# Altium project FlightComputer.PrjPcb (part 1 of 2)
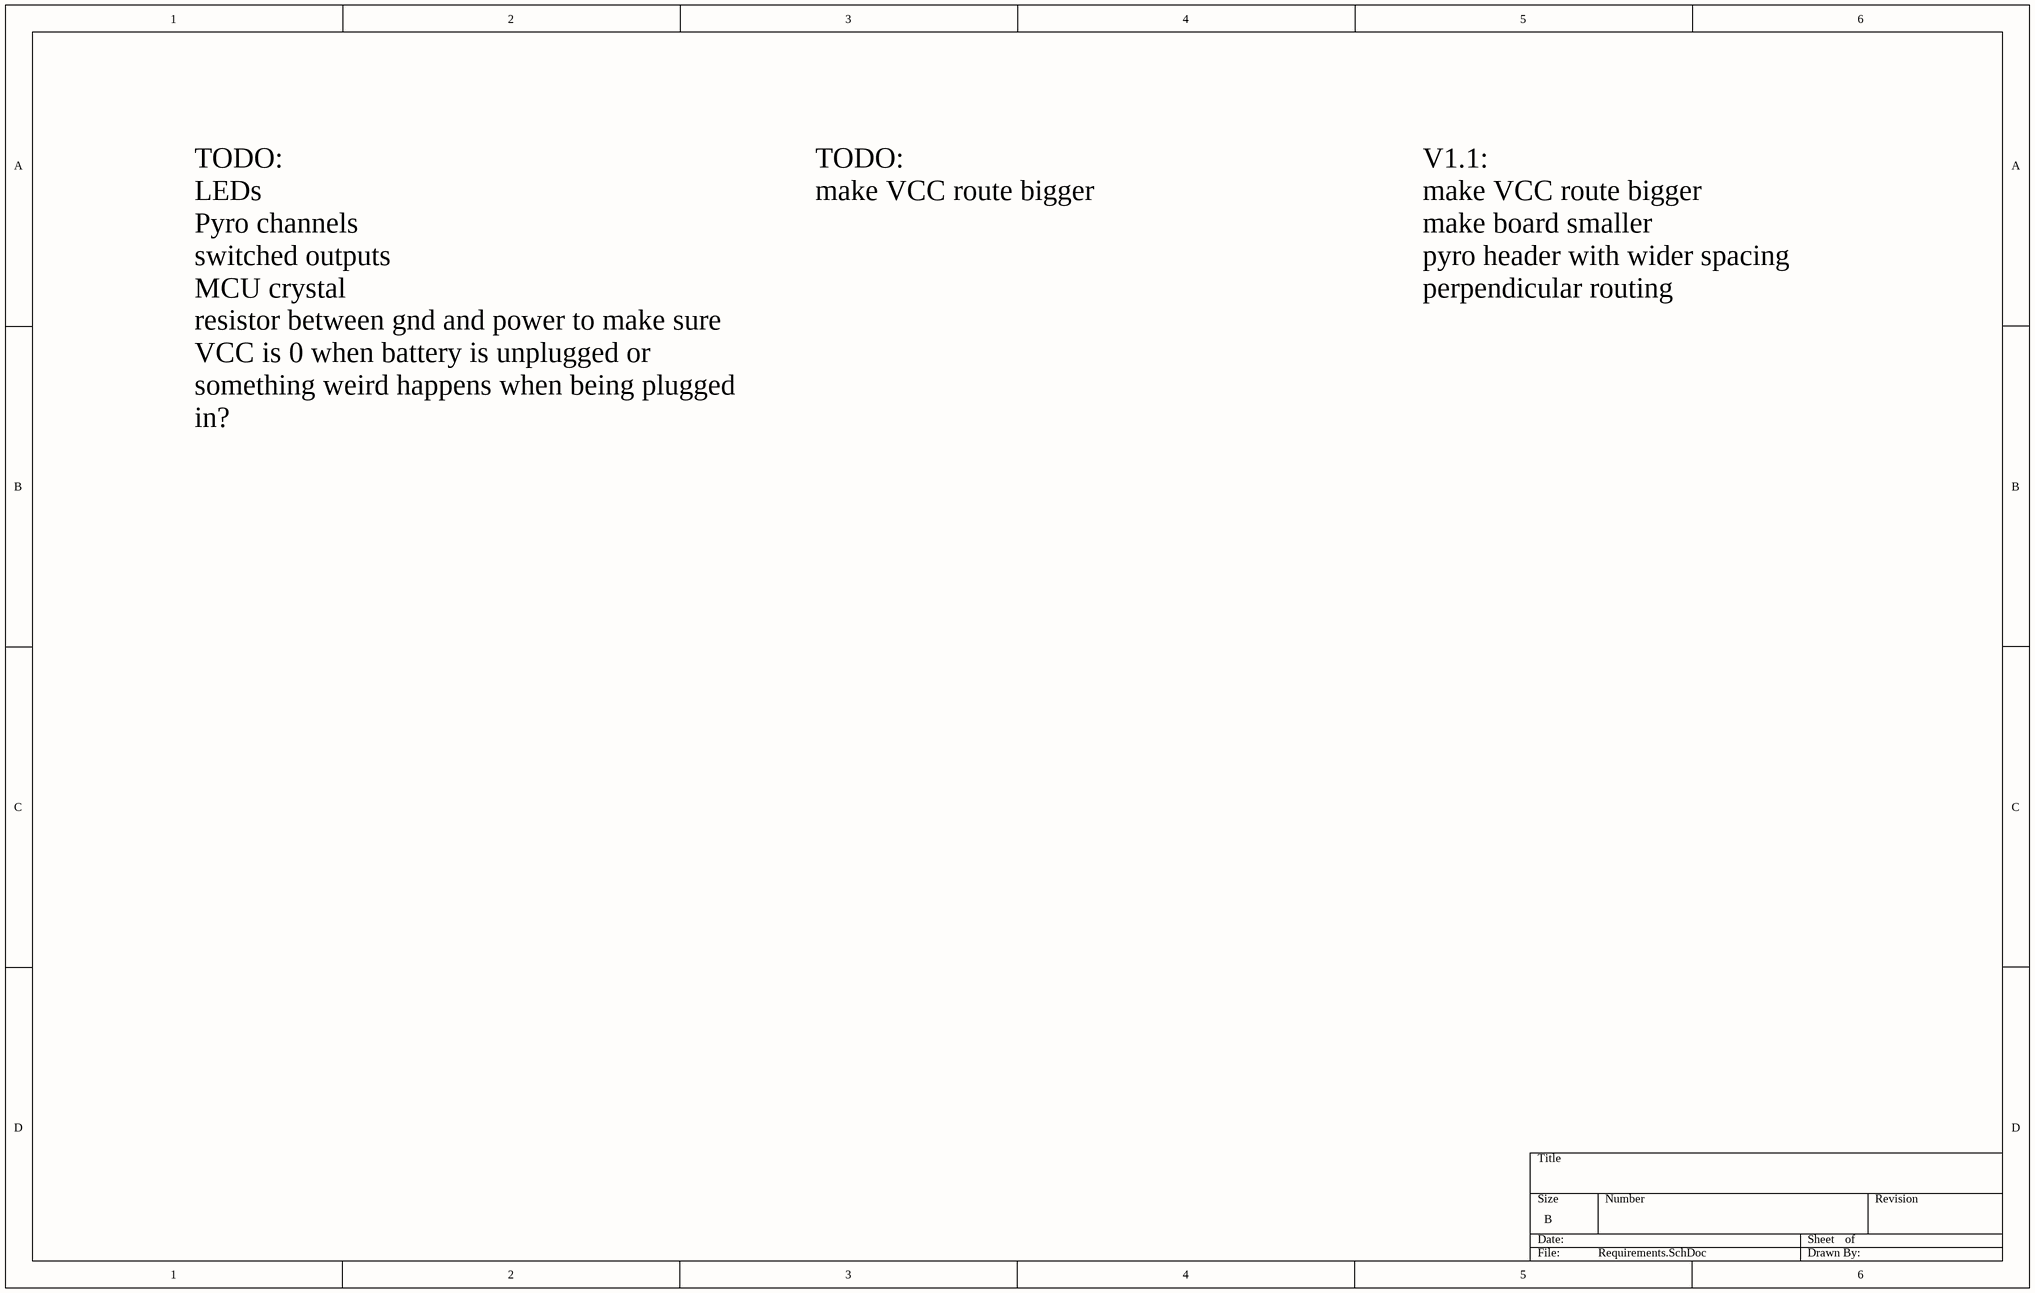
[diagram p0: Requirements.SchDoc]
7 sheets, 223 parts. Net scope: global (net labels, ports and power ports of the same name join across sheets).
Board file: PCB1.PcbDoc
Sheets:
  Requirements.SchDoc
  Power Supply.SchDoc
  Sensors.SchDoc
  MCU.SchDoc
  Pyro.SchDoc
  Misc Controls.SchDoc
  IO.SchDoc

## Sheet Requirements.SchDoc
size B; SheetNumber: 1; SheetTotal: 7

### Notes on the sheet
- TODO:
  LEDs
  Pyro channels
  switched outputs
  MCU crystal
  resistor between gnd and power to make sure VCC is 0 when battery is unplugged or something weird happens when being plugged in?
- TODO:
  make VCC route bigger
- V1.1:
  make VCC route bigger
  make board smaller
  pyro header with wider spacing
  perpendicular routing

## Sheet Power Supply.SchDoc
size B; SheetNumber: 2; SheetTotal: 7; SPICEModelCacheACFILVDY: <root> / <DocumentId>ACFILVDY</DocumentId> / <CacheFrame Number="0"> / <Model Name="0603_150060bs75000" Kind="CKT"> / <Text>****** / .subckt 0603_150060BS75000  1  2 / D1 1 2 SMCW / .MODEL SMCW D / + IS=316.72E-15 / + N=3.9746 / + RS=1.2476 / + IKF=130.15E-6 / + CJO=1.0000E-12 / + M=.3333 / + VJ=.75 / + BV=5 / + IBV=10.00E-6 / + TT=5.0000E-9 / .ends</Text> / </Model> / </CacheFrame> / </root>
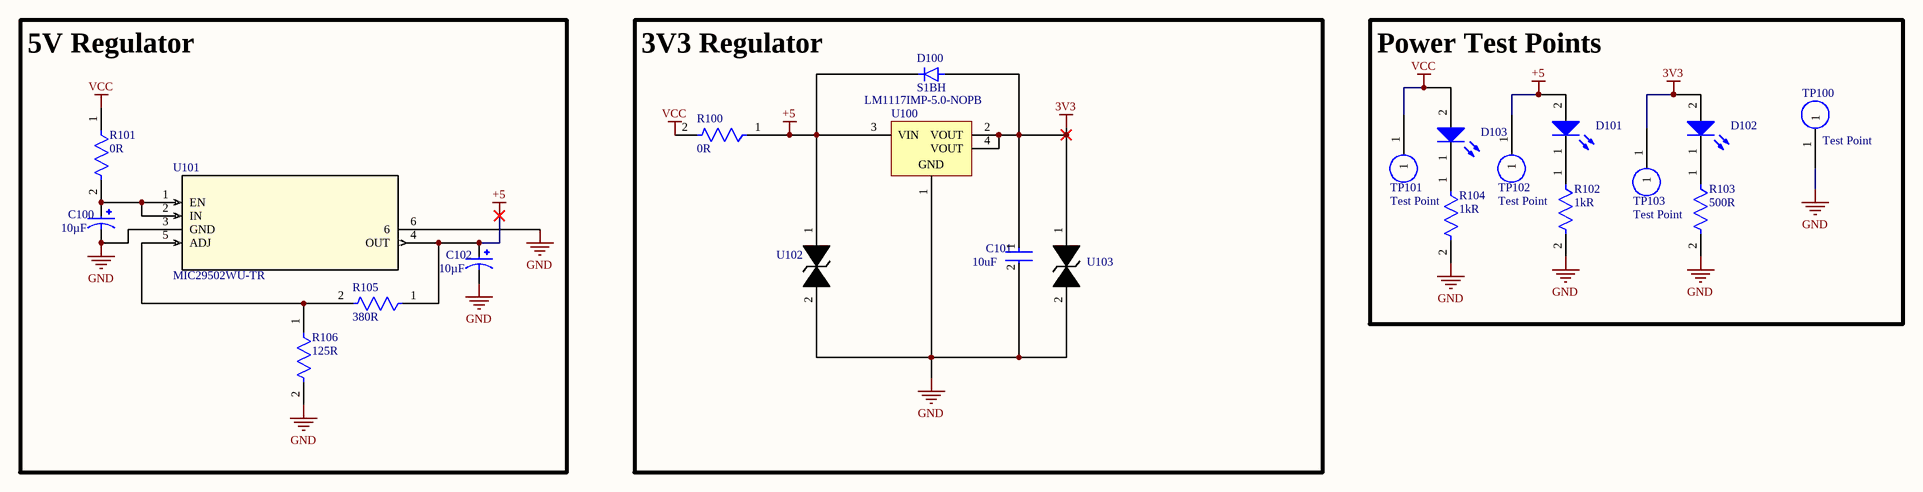
[diagram p1: Power Supply.SchDoc]

### Parts
C100  value 10µF  [CAP_EEEFN1C100R]  (hidden comment: EEEFN1C100R)
C101  Capacitance: 10uF  [FP-GRM21B-0_15-IPC_C]  (hidden comment: GRM21BR61E106KA73L)
C102  value 10µF  [CAP_EEEFN1C100R]  (hidden comment: EEEFN1C100R)
D100  S1BH  [DIOM4325X250N]
D101  150060BS75000  [WL-SMCW_0603_150060xx75000]  (value not drawn)
D102  150060BS75000  [WL-SMCW_0603_150060xx75000]  (value not drawn)
D103  150060BS75000  [WL-SMCW_0603_150060xx75000]  (value not drawn)
R100  value 0R  [FP-CPF0603-MFG]  (hidden comment: CPF0603B2K15E1)
R101  value 0R  [FP-CPF0603-MFG]  (hidden comment: CPF0603B2K15E1)
R102  value 1kR  [FP-CPF0603-MFG]  (hidden comment: CPF0603B2K15E1)
R103  value 500R  [FP-CPF0603-MFG]  (hidden comment: CPF0603B2K15E1)
R104  value 1kR  [FP-CPF0603-MFG]  (hidden comment: CPF0603B2K15E1)
R105  value 380R  [FP-CPF0603-MFG]  (hidden comment: CPF0603B2K15E1)
R106  value 125R  [FP-CPF0603-MFG]  (hidden comment: CPF0603B2K15E1)
TP100  Test Point  [2mm TP]
TP101  Test Point  [2mm TP]
TP102  Test Point  [2mm TP]
TP103  Test Point  [2mm TP]
U100  LM1117IMP-5.0-NOPB  [DCY0004A_M]
U101  MIC29502WU-TR  [TO-263-5_MCH]
U102  SP1003-01ETG  [SP1003-01ETG_LTF]  (value not drawn)
U103  SP1003-01ETG  [SP1003-01ETG_LTF]  (value not drawn)

### Blocks framed on the sheet
5V Regulator: C100 C102 R101 R105 R106 U101
3V3 Regulator: C101 D100 R100 U100 U102 U103
Power Test Points: D101-D103 R102-R104 TP100-TP103

### Nets
3V3: C101.1 D100.A D102.2(A) TP103.1 U100.2(VOUT) U100.4(VOUT) U103.1
+5: C102.1 D100.C(K) D101.2(A) R100.1 R105.1 TP102.1 U100.3(VIN) U101.4(OUT) U102.1
GND: C100.2 C101.2 C102.2 R102.2 R103.2 R104.2 R106.2 TP100.1 U100.1(GND) U101.3(GND) U101.6 U102.2 U103.2  [project net Pyro1-]
VCC: D103.2(A) R100.2 R101.1 TP101.1
NetC100_1: C100.1 R101.2 U101.1(EN) U101.2(IN)
NetD101_1: D101.1(K) R102.1
NetD102_1: D102.1(K) R103.1
NetD103_1: D103.1(K) R104.1
NetR105_2: R105.2 R106.1 U101.5(ADJ)

### Library data of the parts
C100 C102 = CMP-001-00085-1: 10ÂµF 16V Aluminum Electrolytic Capacitors Radial, Can - SMD 1.35Ohm @ 100kHz 2000 Hrs @ 105Â°C; MF: Panasonic; Digi-Key_Part_Number: 10-EEE-FN1C100RCT-ND; Design Item ID: EEEFN1C100R; Check_prices: https://www.snapeda.com/parts/EEEFN1C100R/Panasonic/view-part/5793981/?ref=eda; MP: EEEFN1C100R; Source: EEEFN1C100R.SchLib; Case/Package: RADIAL-2 Panasonic; Component Type: Standard; Pins: 2; SnapEDA_Link: https://www.snapeda.com/parts/EEEFN1C100R/Panasonic/view-part/5793981/?ref=snap
C101 = CMP-2007-03541-2: Chip Multilayer Ceramic Capacitors for General Purpose, 0805, 10uF, X5R, 15%, 10%, 25V; Length: 2mm; Depth: 1.25mm; Termination: SMD/SMT; Voltage: 25V; Height: 1.25mm; Material: Ceramic; Thickness: 0.053inch; Radiation Hardening: No; Min Operating Temperature: -55°C; Width: 0.049inch; Package Quantity: 1; Mount: Surface Mount; Dielectric: X5R; Packaging: Tape and Reel; Voltage Rating (DC): 25V; Lead Free: Lead Free; Max Operating Temperature: 85°C; Case Code (Imperial): 0805; Case/Package: 0805; Tolerance: 10%; Voltage Rating: 25V; Case Code (Metric): 2012
D100 = CMP-004-00033-1: Case/Package: None; Design Item ID: S1BH; Component Type: Standard; Availability: Unavailable; Price: None; Source: S1BH.SchLib; Value: *; Pins: 2; MP: S1BH
D101-D103 = CMP-004-00039-1: WL-SMCW Mono-color Chip LED Waterclear, SMT, size 0603, Blue, 3.2V, 140°; Manufacturer: Wurth Elektronik; Dominant Wavelength: 470nm; Luminous Intensity: 145mcd; Peak Wavelength: 465nm; Chip Technology: InGaN; Mount: Surface Mount; Viewing Angle: 140°; Component Type: Standard; Match Code: WL-SMCW; Emitting Color: Blue; Length: 1.6mm; ComponentLink1URL: https://www.we-online.com/redexpert/article/150060BS75000?ad; Design Item ID: 150060BS75000; ComponentLink2Description: Datasheet Link; ComponentLink2URL: https://www.we-online.com/redexpert/spec/150060BS75000?ad; Width: 0.8mm; Case/Package: 0603; Manufacturer Part Number: 150060BS75000; Forward Voltage: 3.2V; Source: WL-SMCW.SchLib; Category: Signal LEDs; Operating Temperature Min: -40°C; Pins: 2; ComponentLink1Description: Website Link; Height: 0.7mm; Operating Temperature Max: 85°C; Packaging: Tape and Reel
R100-R106 = CMP-03211-008657-1: RES SMD 2.15KΩ 0.1% 1/16W 0603; Manufacturer: TE Connectivity; Temperature Coefficient: 25ppm/°C; Voltage Rating: 50V; Power Rating: 0.063W; Height: 0.55mm; Series: CPF; ComponentLink2Description: Datasheet; Package: CPF0603; Automotive: No; octopart_url: https://octopart.com/cpf0603b2k15e1-te+connectivity-22739551; Lead Free: Yes; Temperature: -55°C to +155°C; RoHS: TRUE; Ipc Land Pattern Name: RESC15580X45; Temperature Range Low: -55°C; Composition: Thin Film; Device Class L3: Chip SMD Resistors; Category: Res; Octopart: https://octopart.com/cpf0603b2k15e1-te+connectivity-22739551; Resistance: 2.15KΩ; ComponentLink2URL: https://www.te.com/commerce/DocumentDelivery/DDEController?Action=showdoc&DocId=Data+Sheet%7F1773200%7FM%7Fpdf%7FEnglish%7FENG_DS_1773200_M.pdf%7F3-1676481-2; Manufacturer Part Number: CPF0603B2K15E1; packaging: 1k Reel; Tolerance: 0.1%; Temperature Range High: +155°C; Device Class L1: Passive Components; Device Class L2: Resistors
TP101 = CMP-096-000000-1: Source: Test_Points.SchLib; Design Item ID: Test Point
U100 = CMP-019-00021-3: Low-Dropout Linear Regulator, 800 mA, -40 to 125 degC, 4-Pin SOT-223 (DCY), Green (RoHS & no Sb/Br), Tape and Reel; Manufacturer: Texas Instruments; Dropout Voltage: 1.2V; Nominal Output Voltage: 5V; Max Ouput Current: 800mA; Outputs: 1; Min Input Voltage: 2.6V; Max Input Voltage: 15V; Manufacturer URL: http://www.ti.com/; Max Operating Temperature: 125°C; Packaging: TapeandReel; RoHS Compliant: True; Output Voltage: 5V; Pins: 4; Package Description: 4-Pin Small Outline Transistor, Body 6.5 x 3.5 mm, Pitch 2.3 mm; Min Operating Temperature: -40°C; Mounting Technology: SM; Output Current: 800mA; Case/Package: SOT-223; Datasheet Version: SNOS412N, 01/2016; Datasheet URL: http://www.ti.com/lit/ds/symlink/lm1117.pdf; Package Reference: DCY0004A
U101 = CMP-098-000000-1: No Description Available; Mfr_Name: Microchip; Type: Type; RefDes: RefDes; Design Item ID: MIC29502WU-TR; Source: MIC29502WU-TR.SchLib
U102 U103 = CMP-104-000000-3: No Description Available; Mfr_Name: Littelfuse Inc; Source: SP1003-01ETG.SchLib; Design Item ID: SP1003-01ETG; Type: Type; RefDes: RefDes
TP100 TP102 TP103 = Test Point: Source: Test_Points.SchLib; Design Item ID: Test Point

## Sheet Sensors.SchDoc
size C; SheetNumber: 3; SheetTotal: 7
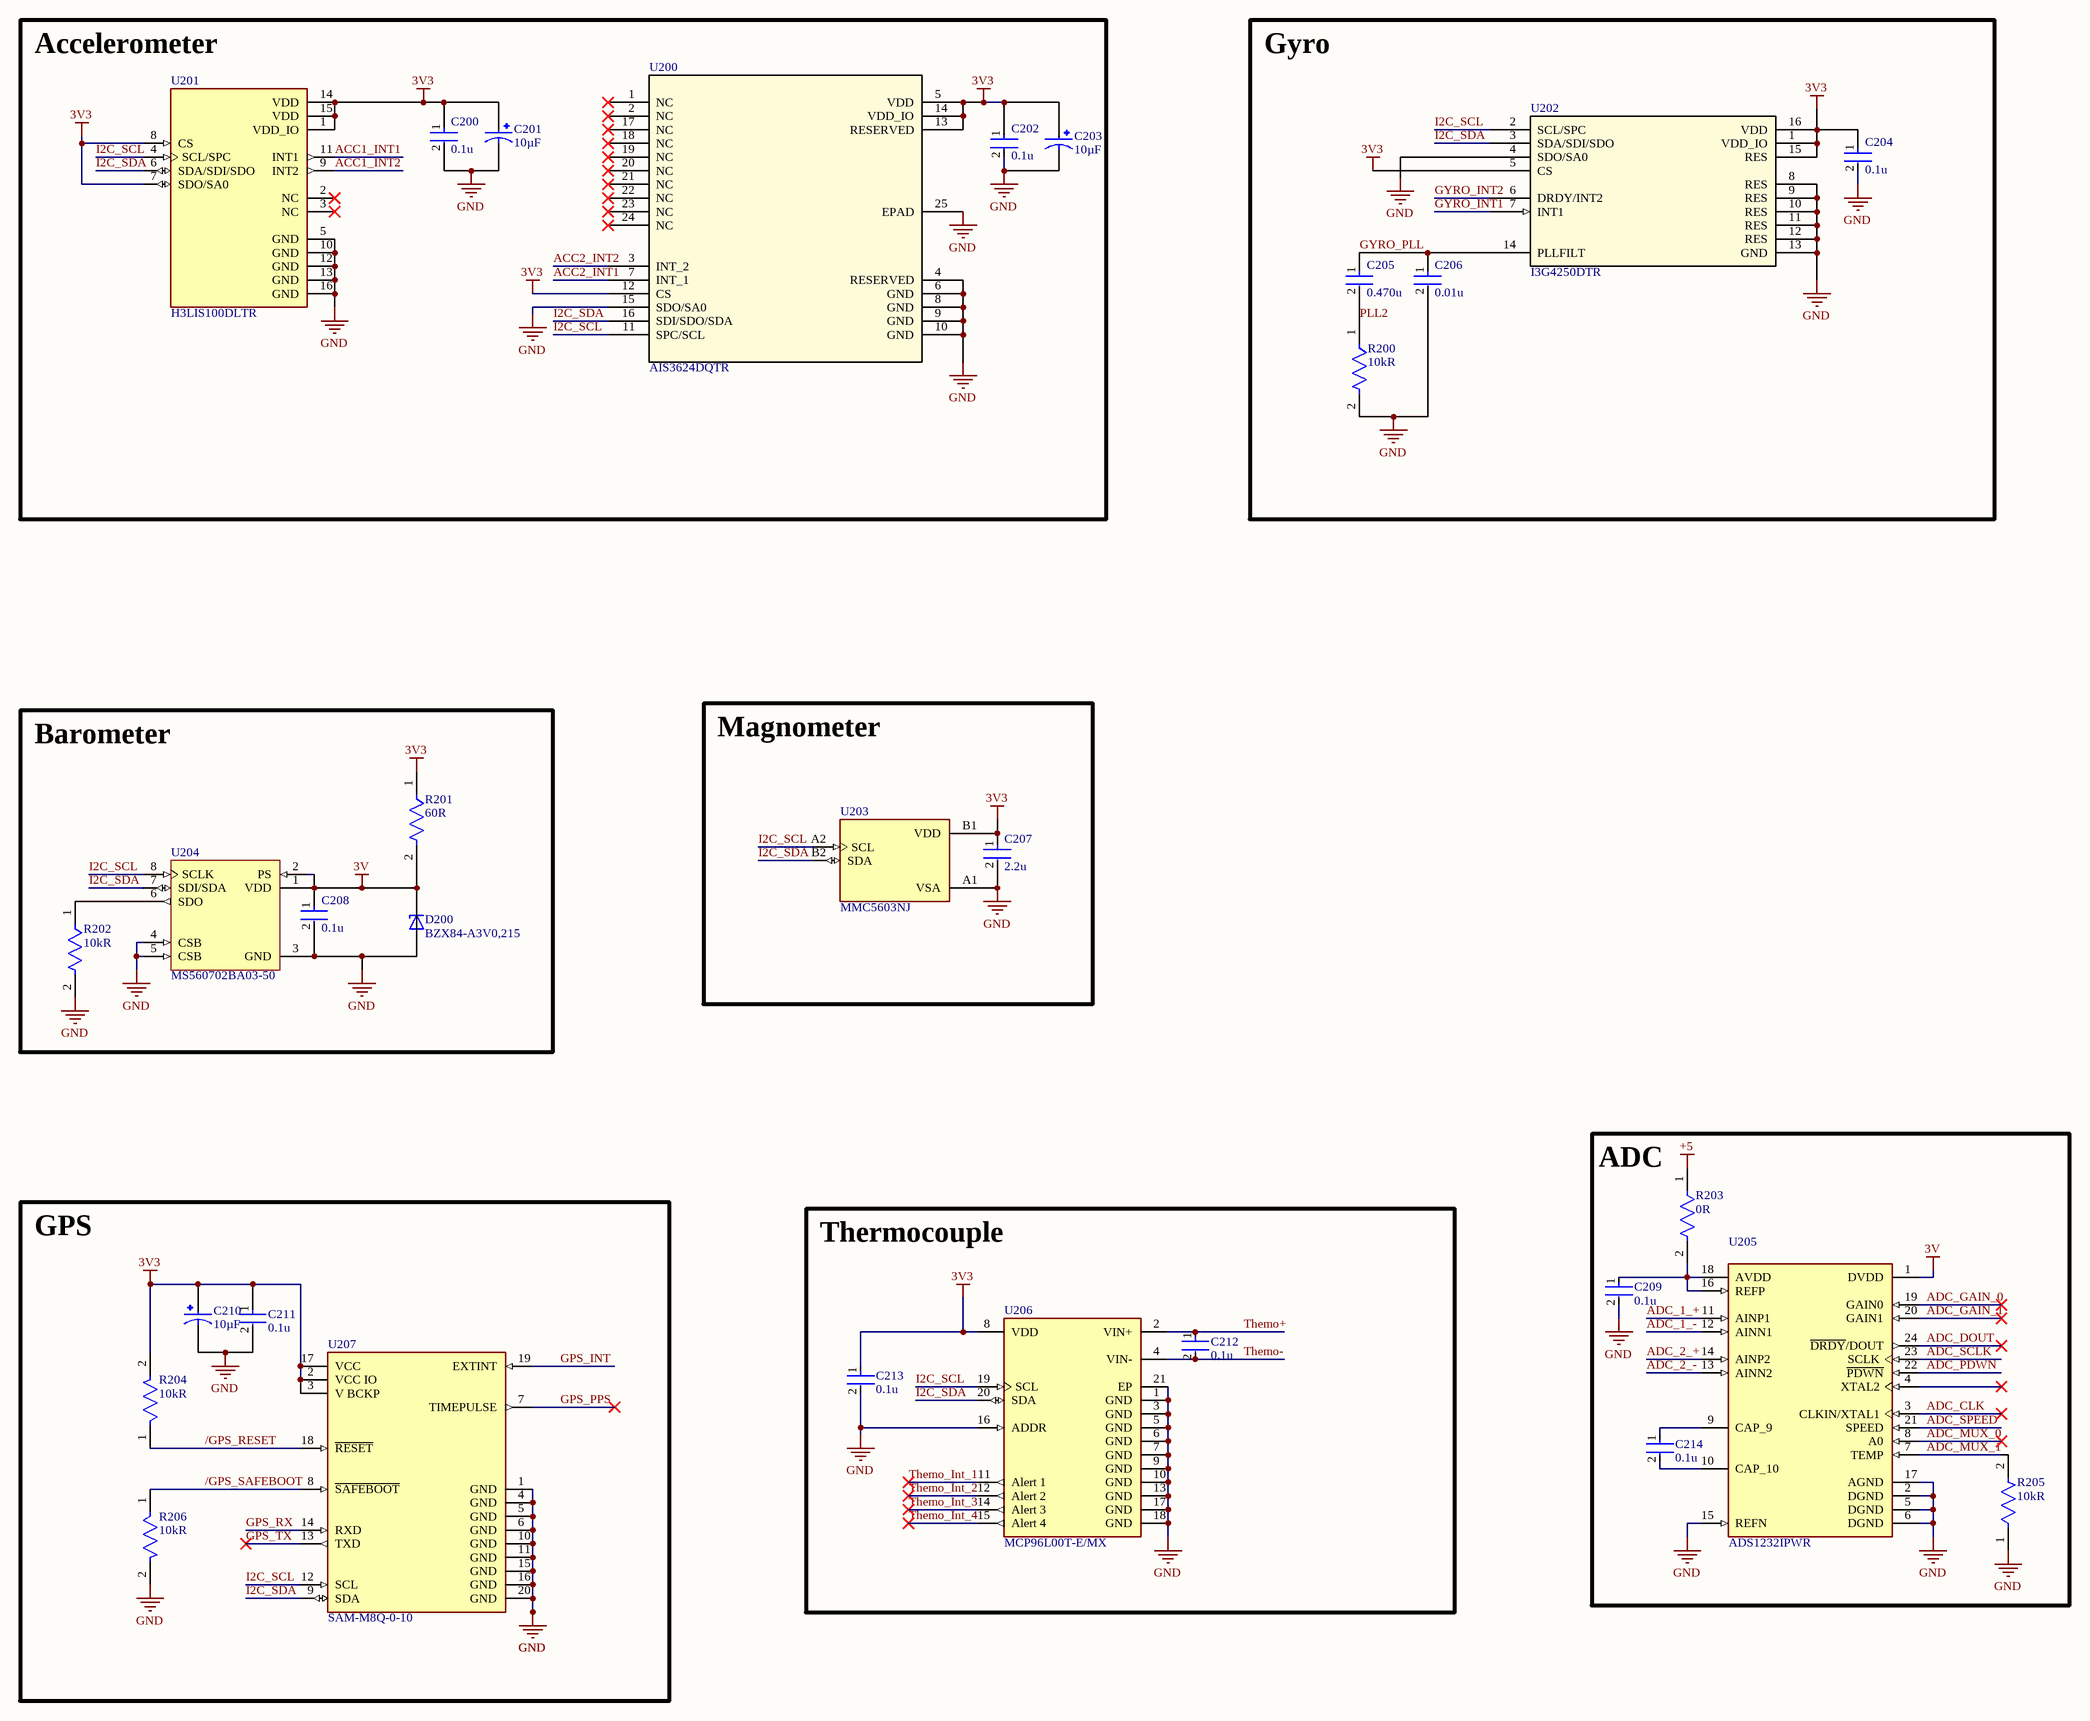
[diagram p2: Sensors.SchDoc]

### Parts
C200  Capacitance: 0.1u  [FP-CL10-IPC_A]  (hidden comment: CL10C681JB8NFNC)
C201  value 10µF  [CAP_EEEFN1C100R]  (hidden comment: EEEFN1C100R)
C202  Capacitance: 0.1u  [FP-CL10-IPC_A]  (hidden comment: CL10C681JB8NFNC)
C203  value 10µF  [CAP_EEEFN1C100R]  (hidden comment: EEEFN1C100R)
C204  Capacitance: 0.1u  [FP-CL10-IPC_A]  (hidden comment: CL10C681JB8NFNC)
C205  Capacitance: 0.470u  [FP-CL10-IPC_A]  (hidden comment: CL10C681JB8NFNC)
C206  Capacitance: 0.01u  [FP-CL10-IPC_A]  (hidden comment: CL10C681JB8NFNC)
C207  Capacitance: 2.2u  [FP-CL10-IPC_A]  (hidden comment: CL10C681JB8NFNC)
C208  Capacitance: 0.1u  [FP-CL10-IPC_A]  (hidden comment: CL10C681JB8NFNC)
C209  Capacitance: 0.1u  [FP-CL10-IPC_A]  (hidden comment: CL10C681JB8NFNC)
C210  value 10µF  [CAP_EEEFN1C100R]  (hidden comment: EEEFN1C100R)
C211  Capacitance: 0.1u  [FP-CL10-IPC_A]  (hidden comment: CL10C681JB8NFNC)
C212  Capacitance: 0.1u  [FP-CL10-IPC_A]  (hidden comment: CL10C681JB8NFNC)
C213  Capacitance: 0.1u  [FP-CL10-IPC_A]  (hidden comment: CL10C681JB8NFNC)
C214  Capacitance: 0.1u  [FP-CL10-IPC_A]  (hidden comment: CL10C681JB8NFNC)
D200  BZX84-A3V0,215  [SOT95P230X110-3N]
R200  value 10kR  [FP-CPF0603-MFG]  (hidden comment: CPF0603B2K15E1)
R201  value 60R  [FP-CPF0603-MFG]  (hidden comment: CPF0603B2K15E1)
R202  value 10kR  [FP-CPF0603-MFG]  (hidden comment: CPF0603B2K15E1)
R203  value 0R  [FP-CPF0603-MFG]  (hidden comment: CPF0603B2K15E1)
R204  value 10kR  [FP-CPF0603-MFG]  (hidden comment: CPF0603B2K15E1)
R205  value 10kR  [FP-CPF0603-MFG]  (hidden comment: CPF0603B2K15E1)
R206  value 10kR  [FP-CPF0603-MFG]  (hidden comment: CPF0603B2K15E1)
U200  AIS3624DQTR  [QFN24L_4X4X0P5_STM]
U201  H3LIS100DLTR  [PQFN50P300X300X100-16N]
U202  I3G4250DTR  [LGA-16_4X4X1_STM]
U203  MMC5603NJ  [XDCR_MMC5603NJ]
U204  MS560702BA03-50  [TECO-MS560702BA03-50_V]
U205  ADS1232IPWR  [SOP65P640X120-24N]
U206  MCP96L00T-E/MX  [FP-C04-186-IPC_C]
U207  SAM-M8Q-0-10  [FP-SAM-M8Q-0-10-MFG]

### Blocks framed on the sheet
Accelerometer: C200-C203 U200 U201
Gyro: C204-C206 R200 U202
Barometer: C208 D200 R201 R202 U204
Magnometer: C207 U203
ADC: C209 C214 R203 R205 U205
GPS: C210 C211 R204 R206 U207
Thermocouple: C212 C213 U206

### Nets
3V: C208.1 D200.3(C) R201.2 U204.1(VDD) U204.2(PS) U205.1(DVDD)
3V3: C200.1 C201.1 C202.1 C203.1 C204.1 C207.1 C210.1 C211.1 C213.1 R201.1 R204.2 U200.5(VDD) U200.12(CS) U200.13(RESERVED) U200.14(VDD_IO) U201.1(VDD_IO) U201.7(SDO/SA0) U201.8(CS) U201.14(VDD) U201.15(VDD) U202.1(VDD_IO) U202.5(CS) U202.15(RES) U202.16(VDD) U203.B1(VDD) U206.8(VDD) U207.2(VCC_IO) U207.3(V_BCKP) U207.17(VCC)
+5: R203.1
GND: C200.2 C201.2 C202.2 C203.2 C204.2 C206.2 C207.2 C208.2 C209.2 C210.2 C211.2 C213.2 D200.1(A) R200.2 R202.2 R205.1 R206.2 U200.4(RESERVED) U200.6(GND) U200.8(GND) U200.9(GND) U200.10(GND) U200.15(SDO/SA0) U200.25(EPAD) U201.5(GND) U201.10(GND) U201.12(GND) U201.13(GND) U201.16(GND) U202.4(SDO/SA0) U202.8(RES) U202.9(RES) U202.10(RES) U202.11(RES) U202.12(RES) U202.13(GND) U203.A1(VSA) U204.3(GND) U204.4(CSB) U204.5(CSB) U205.2(DGND) U205.5(DGND) U205.6(DGND) U205.15(REFN) U205.17(AGND) U206.1(GND) U206.3(GND) U206.5(GND) U206.6(GND) U206.7(GND) U206.9(GND) U206.10(GND) U206.13(GND) U206.16(ADDR) U206.17(GND) U206.18(GND) U206.21(EP) U207.1(GND) U207.4(GND) U207.5(GND) U207.6(GND) U207.10(GND) U207.11(GND) U207.15(GND) U207.16(GND) U207.20(GND)  [project net Pyro1-]
/GPS_RESET: R204.1 U207.18(~{RESET})
/GPS_SAFEBOOT: R206.1 U207.8(~{SAFEBOOT})
ACC1_INT1: U201.11(INT1)
ACC1_INT2: U201.9(INT2)
ACC2_INT1: U200.7(INT_1)
ACC2_INT2: U200.3(INT_2)
ADC_1_+: U205.11(AINP1)
ADC_1_-: U205.12(AINN1)
ADC_2_+: U205.14(AINP2)
ADC_2_-: U205.13(AINN2)
ADC_CLK: U205.3(CLKIN/XTAL1)
ADC_DOUT: U205.24(~{DRDY}/DOUT)
ADC_GAIN_0: U205.19(GAIN0)
ADC_GAIN_1: U205.20(GAIN1)
ADC_MUX_0: U205.8(A0)
ADC_MUX_1: R205.2 U205.7(TEMP)
ADC_PDWN: U205.22(~{PDWN})
ADC_SCLK: U205.23(SCLK)
ADC_SPEED: U205.21(SPEED)
GPS_INT: U207.19(EXTINT)
GPS_PPS: U207.7(TIMEPULSE)
GPS_RX: U207.14(RXD)
GPS_TX: U207.13(TXD)
GYRO_INT1: U202.7(INT1)
GYRO_INT2: U202.6(DRDY/INT2)
GYRO_PLL: C205.1 C206.1 U202.14(PLLFILT)
I2C_SCL: U200.11(SPC/SCL) U201.4(SCL/SPC) U202.2(SCL/SPC) U203.A2(SCL) U204.8(SCLK) U206.19(SCL) U207.12(SCL)
I2C_SDA: U200.16(SDI/SDO/SDA) U201.6(SDA/SDI/SDO) U202.3(SDA/SDI/SDO) U203.B2(SDA) U204.7(SDI/SDA) U206.20(SDA) U207.9(SDA)
PLL2: C205.2 R200.1
Themo+: C212.1 U206.2(VIN+)
Themo-: C212.2 U206.4(VIN-)
Themo_Int_1: U206.11(Alert_1)
Themo_Int_2: U206.12(Alert_2)
Themo_Int_3: U206.14(Alert_3)
Themo_Int_4: U206.15(Alert_4)
NetC209_1: C209.1 R203.2 U205.16(REFP) U205.18(AVDD)
NetC214_1: C214.1 U205.9(CAP_9)
NetC214_2: C214.2 U205.10(CAP_10)
NetR202_1: R202.1 U204.6(SDO)

Not connected (* = marked no-connect by the designer): U200 1(NC)* 2(NC)* 17(NC)* 18(NC)* 19(NC)* 20(NC)* 21(NC)* 22(NC)* 23(NC)* 24(NC)*; U201 2(NC)* 3(NC)*; U205 4(XTAL2)*

### Library data of the parts
C200 C202 C204-C209 C211-C214 = CMP-13271-001533-1: Cap Ceramic 680pF 50V C0G ±5% Pad SMD 0603 +125°C T/R; Voltage Rating: 50V; Radiation Hardening: No; Length: 0.063inch; Min Operating Temperature: -55°C; Package Quantity: 1; Lead Free: Lead Free; Case Code (Metric): 1608; Thickness: 0.035inch; Width: 0.031inch; Height: 0.8mm; Case/Package: 0603; Tolerance: 5%; Mount: Surface Mount; Dielectric: C0G; Max Operating Temperature: 125°C; Case Code (Imperial): 0603; Packaging: Tape and Reel; Depth: 0.8mm
C201 C203 C210 = CMP-001-00085-1: as C100 on sheet Power Supply; Digi-Key_Part_Number: 10-EEE-FN1C100RCT-ND; Design Item ID: EEEFN1C100R; Check_prices: https://www.snapeda.com/parts/EEEFN1C100R/Panasonic/view-part/5793981/?ref=eda; MP: EEEFN1C100R; Source: EEEFN1C100R.SchLib; Case/Package: RADIAL-2 Panasonic; Component Type: Standard; Pins: 2; SnapEDA_Link: https://www.snapeda.com/parts/EEEFN1C100R/Panasonic/view-part/5793981/?ref=snap
D200 = CMP-004-00034-1: Zener Diode 3 V 250 mW Â±1% Surface Mount TO-236AB; MF: Nexperia; Value: *; Source: BZX84-A3V0,215.SchLib; Case/Package: SOT23-3 Nexperia USA Inc.; Pins: 2; Component Type: Standard; MP: BZX84-A3V0,215; SnapEDA_Link: https://www.snapeda.com/parts/BZX84-C3V0,215/Nexperia/view-part/?ref=snap; Check_prices: https://www.snapeda.com/parts/BZX84-C3V0,215/Nexperia/view-part/?ref=eda; Design Item ID: BZX84-A3V0,215
R200-R206 = CMP-03211-008657-1: as R100 on sheet Power Supply; Height: 0.55mm; Series: CPF; ComponentLink2Description: Datasheet; Package: CPF0603; Automotive: No; octopart_url: https://octopart.com/cpf0603b2k15e1-te+connectivity-22739551; Lead Free: Yes; Temperature: -55°C to +155°C; RoHS: TRUE; Ipc Land Pattern Name: RESC15580X45; Temperature Range Low: -55°C; Composition: Thin Film; Device Class L3: Chip SMD Resistors; Category: Res; Octopart: https://octopart.com/cpf0603b2k15e1-te+connectivity-22739551; Resistance: 2.15KΩ; ComponentLink2URL: https://www.te.com/commerce/DocumentDelivery/DDEController?Action=showdoc&DocId=Data+Sheet%7F1773200%7FM%7Fpdf%7FEnglish%7FENG_DS_1773200_M.pdf%7F3-1676481-2; Manufacturer Part Number: CPF0603B2K15E1; packaging: 1k Reel; Tolerance: 0.1%; Temperature Range High: +155°C; Device Class L1: Passive Components; Device Class L2: Resistors
U200 = CMP-045-000000-3: No Description Available; Mfr_Name: STMicroelectronics; Design Item ID: AIS3624DQTR; Source: AIS3624DQTR.SchLib; Type: Type; RefDes: RefDes
U201 = CMP-043-000000-1: Accelerometer X, Y, Z Axis Â±100g 25Hz ~ 200Hz 16-TFLGA (3x3); MF: STMicroelectronics; Package: TFLGA-16 STMicroelectronics; Pin Count: 16; Component Type: Standard; MP: H3LIS100DLTR; Source: H3LIS100DLTR.SchLib; Check_prices: https://www.snapeda.com/parts/H3LIS100DLTR/STMicroelectronics/view-part/?ref=eda; Value: *; Design Item ID: H3LIS100DLTR; SnapEDA_Link: https://www.snapeda.com/parts/H3LIS100DLTR/STMicroelectronics/view-part/?ref=snap
U202 = CMP-051-000001-2: No Description Available; Mfr_Name: STMicroelectronics; Design Item ID: I3G4250DTR; RefDes: RefDes; Source: I3G4250DTR.SchLib; Type: Type
U203 = CMP-069-000000-1: Magnetoresistive Sensor X, Y, Z Axis 4-WLP (0.82x0.82); MF: Memsic Inc.; Price: None; SnapEDA_Link: https://www.snapeda.com/parts/MMC5603NJ/Memsic+Inc./view-part/?ref=snap; Purchase-URL: https://pricing.snapeda.com/search/part/MMC5603NJ/?ref=eda; Availability: In Stock; Design Item ID: MMC5603NJ; Component Type: Standard; Value: *; MP: MMC5603NJ; Check_prices: https://www.snapeda.com/parts/MMC5603NJ/Memsic+Inc./view-part/?ref=eda; Source: MMC5603NJ.SchLib; Package: UFBGA-4 Memsic Inc.; Pin Count: 4
U204 = CMP-010-00024-1: Absolute, 4.35Psi Min, 15.95Psi Max, 0-3V, Rectangular, Surface Mount; Min Supply Voltage: 1.8V; Max Supply Voltage: 3.6V; Sensor Type: PRESSURE SENSOR,PEIZORESISTIVE; Max Operating Temperature: 85°C; Mounting Technology: Surface Mount; Min Operating Temperature: -40°C; RoHS Compliant: Yes
U205 = CMP-019-000000-2: MF: {'manufacturer': u'Texas Instruments'}; Source: ADS1232IPWR.SchLib; Value: *; Availability: Unavailable; Price: None; Package: None; Component Type: Standard; MP: ADS1232IPWR; Pin Count: 24; Design Item ID: ADS1232IPWR
U206 = CMP-06290-000002-1: +/- 4.0C THERMOCOUPLE TO I2C CON; Operating Supply Current: 2.5mA; Mount: Surface Mount; Case/Package: VQFN; Packaging: Tape and Reel; Output Type: I2C; Max Operating Temperature: 125°C; Min Operating Temperature: -40°C
U207 = CMP-207130-000004-3: RF RX GALILEO 1.575GHZ/1.602GHZ; Manufacturer: uBlox; Nominal Supply Current: 9.5-32mA; Sensitivity: -165dBm; Automotive Grade: Grade 3; Max Frequency: 1602MHz; Min Supply Voltage: 2.7V; Max Supply Voltage: 3.6V; Data Rate: 400kbits/s; Interface: I2C,UART,Other; Package: 0; ComponentLink2Description: Datasheet; Octopart: https://octopart.com/sam-m8q-0-10-u-blox-88247750; Temperature Range Low: -40°C; Height: 6.8mm; Category: IC; RoHS: TRUE; Digikey Description: RF RX GALILEO 1.575GHZ/1.602GHZ; Footprint Url: https://www.u-blox.com/sites/default/files/SAM-M8Q_HardwareIntegrationManual_%28UBX-16018358%29.pdf; ComponentLink2URL: https://www.u-blox.com/sites/default/files/SAM-M8Q_DataSheet_%28UBX-16012619%29.pdf; Temperature Range High: +85°C; Device Class L1: Integrated Circuits (ICs); Temperature: -40°C to +85°C; Automotive: Yes; Device Class L2: RF Semiconductors and Devices; Manufacturer Part Number: SAM-M8Q-0-10; Device Class L3: Transceivers; Lead Free: Yes

## Sheet MCU.SchDoc
size D; SheetNumber: 4; SheetTotal: 7
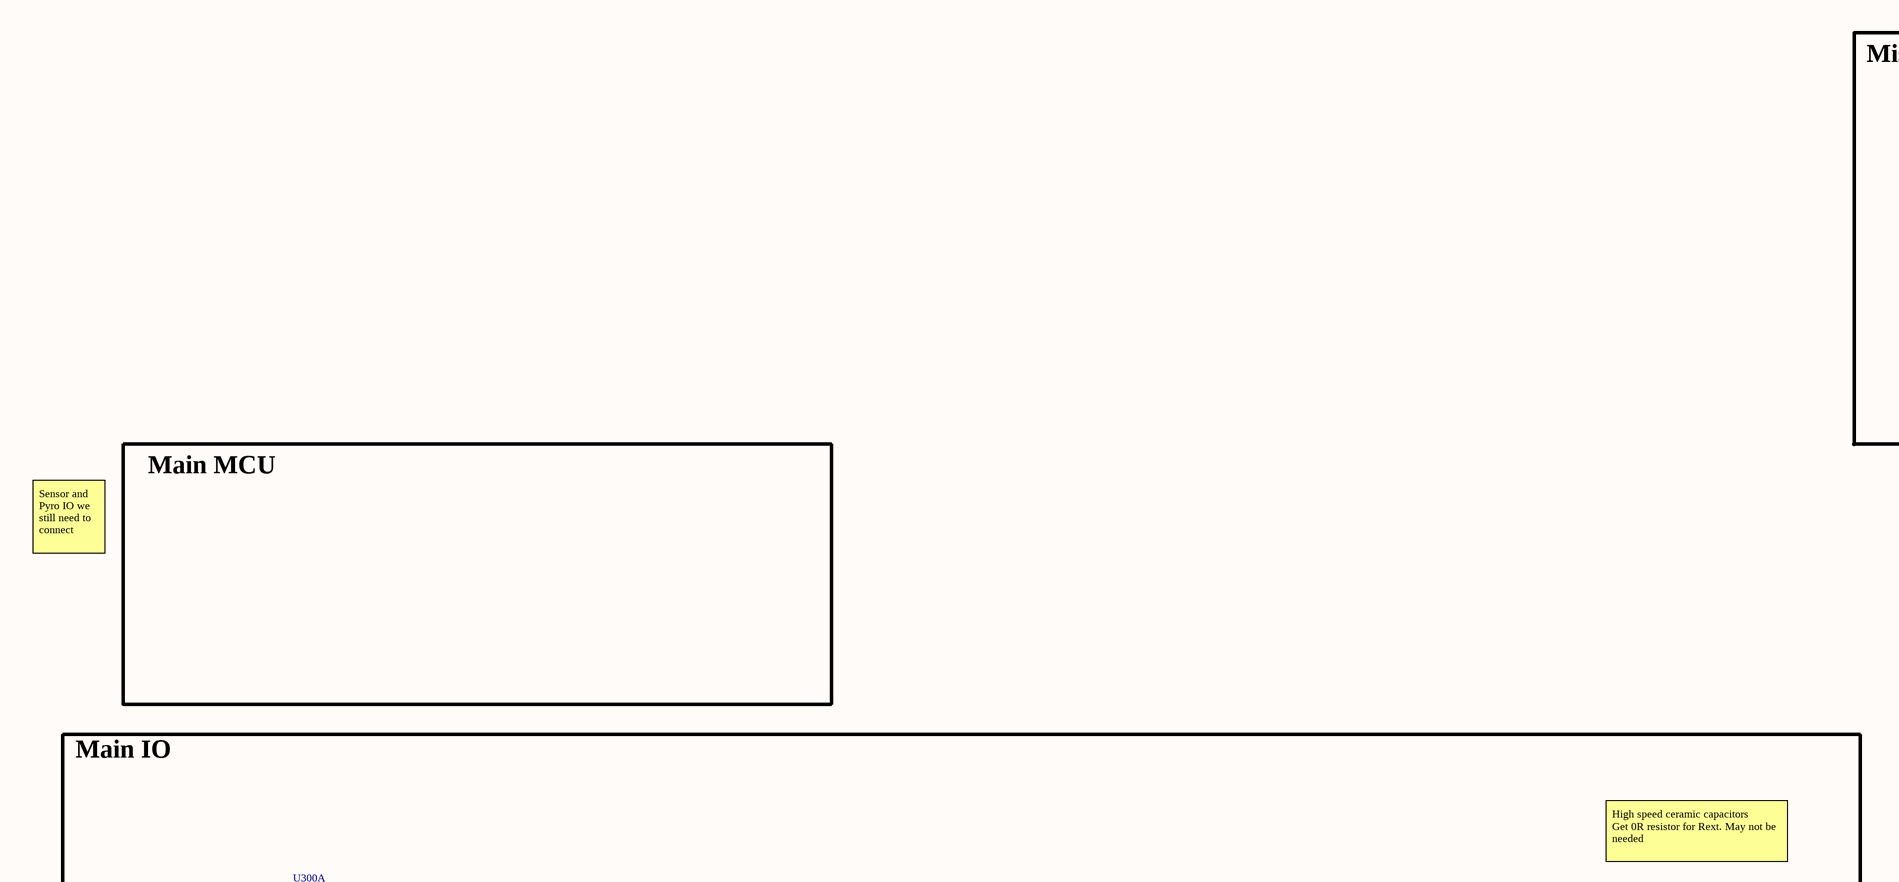
[diagram p3: MCU.SchDoc, top left]
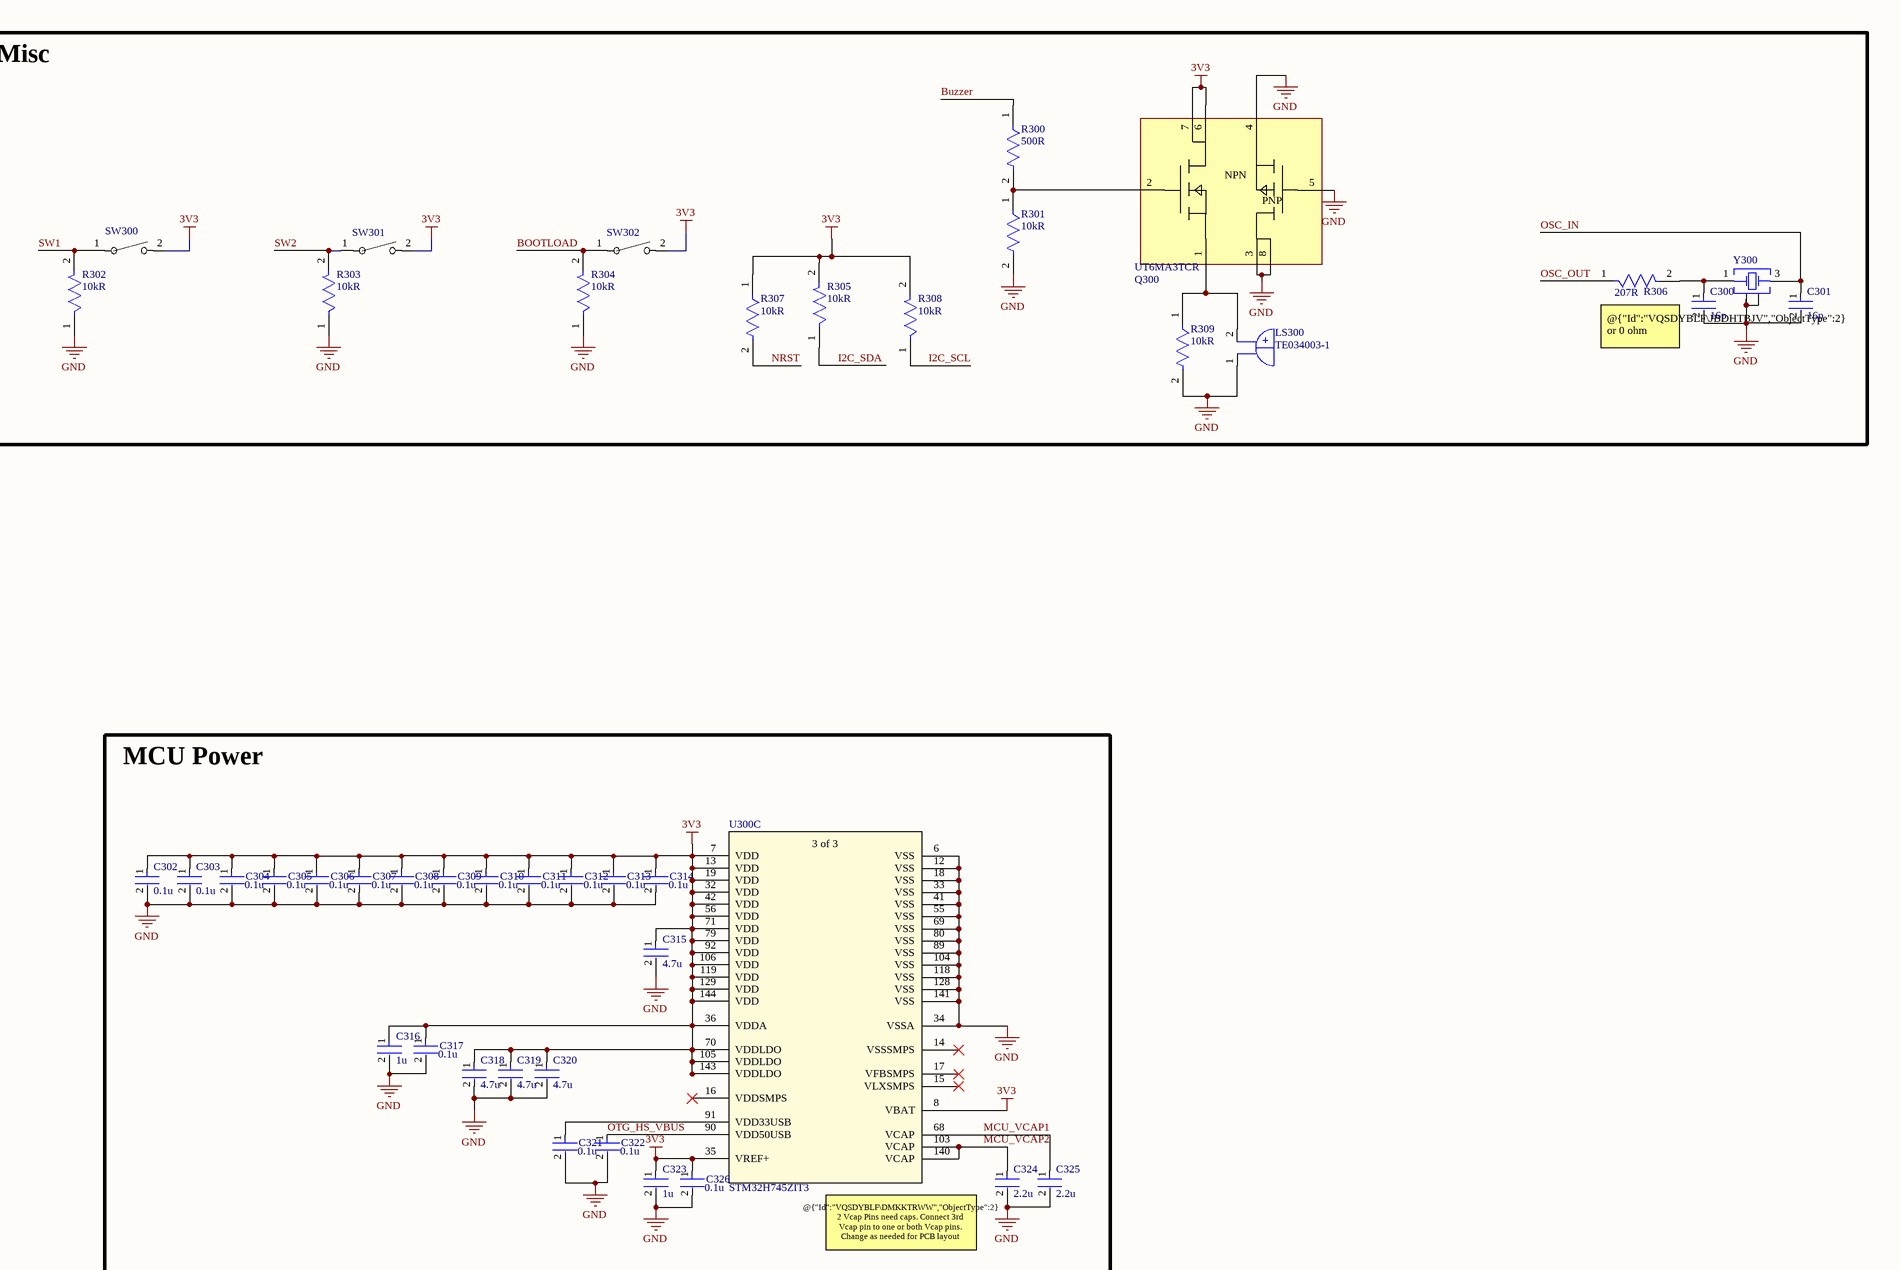
[diagram p4: MCU.SchDoc, top right]
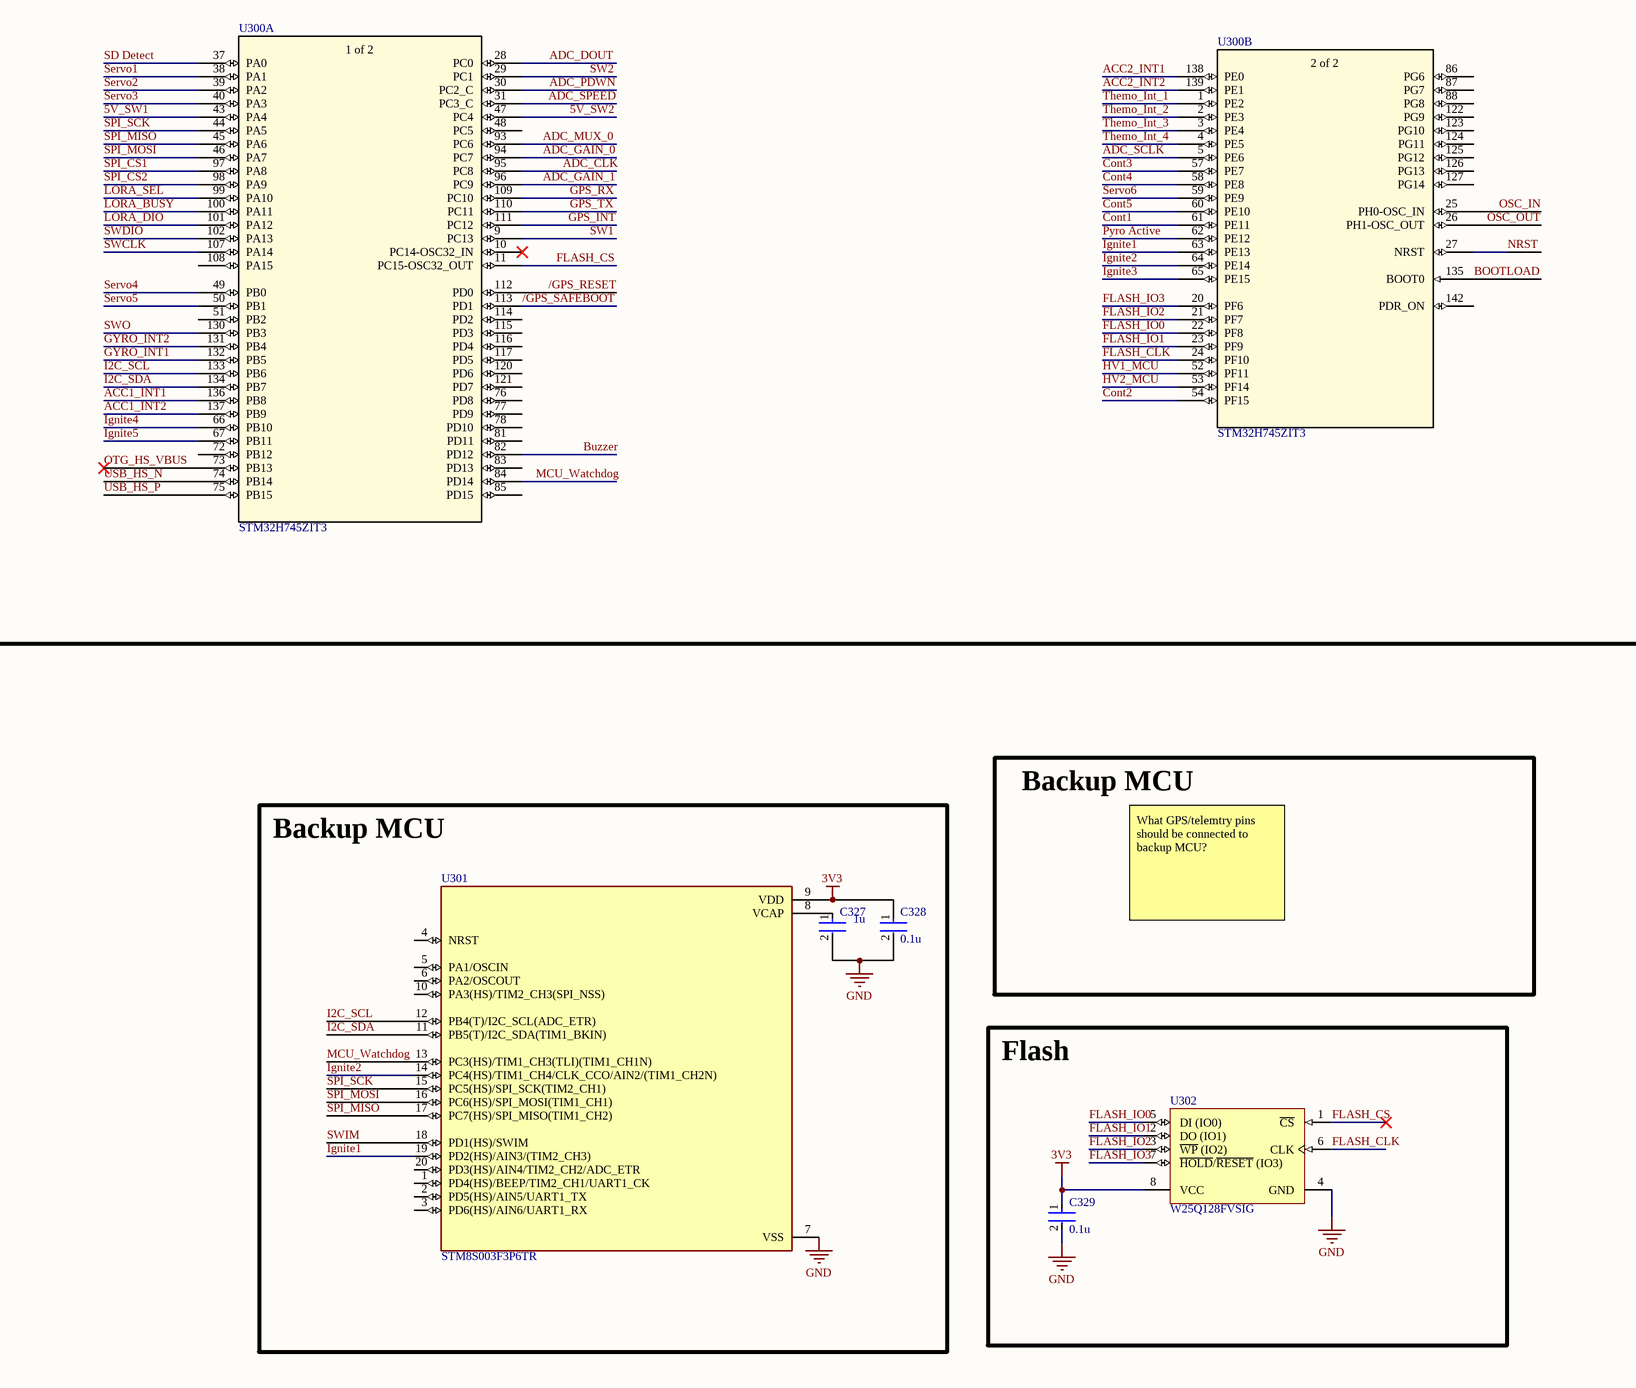
[diagram p5: MCU.SchDoc, bottom left]

### Parts
C300  Capacitance: 16p  [FP-CL10-IPC_A]  (hidden comment: CL10C681JB8NFNC)
C301  Capacitance: 16p  [FP-CL10-IPC_A]  (hidden comment: CL10C681JB8NFNC)
C302  Capacitance: 0.1u  [FP-CL94-IPC_C]  (hidden comment: CL05B104KQ5NNNC)
C303  Capacitance: 0.1u  [FP-CL94-IPC_C]  (hidden comment: CL05B104KQ5NNNC)
C304  Capacitance: 0.1u  [FP-CL94-IPC_C]  (hidden comment: CL05B104KQ5NNNC)
C305  Capacitance: 0.1u  [FP-CL94-IPC_C]  (hidden comment: CL05B104KQ5NNNC)
C306  Capacitance: 0.1u  [FP-CL94-IPC_C]  (hidden comment: CL05B104KQ5NNNC)
C307  Capacitance: 0.1u  [FP-CL94-IPC_C]  (hidden comment: CL05B104KQ5NNNC)
C308  Capacitance: 0.1u  [FP-CL94-IPC_C]  (hidden comment: CL05B104KQ5NNNC)
C309  Capacitance: 0.1u  [FP-CL94-IPC_C]  (hidden comment: CL05B104KQ5NNNC)
C310  Capacitance: 0.1u  [FP-CL94-IPC_C]  (hidden comment: CL05B104KQ5NNNC)
C311  Capacitance: 0.1u  [FP-CL94-IPC_C]  (hidden comment: CL05B104KQ5NNNC)
C312  Capacitance: 0.1u  [FP-CL94-IPC_C]  (hidden comment: CL05B104KQ5NNNC)
C313  Capacitance: 0.1u  [FP-CL94-IPC_C]  (hidden comment: CL05B104KQ5NNNC)
C314  Capacitance: 0.1u  [FP-CL94-IPC_C]  (hidden comment: CL05B104KQ5NNNC)
C315  Capacitance: 4.7u  [FP-CL10-IPC_A]  (hidden comment: CL10C681JB8NFNC)
C316  Capacitance: 1u  [FP-CL10-IPC_A]  (hidden comment: CL10C681JB8NFNC)
C317  Capacitance: 0.1u  [FP-CL94-IPC_C]  (hidden comment: CL05B104KQ5NNNC)
C318  Capacitance: 4.7u  [FP-CL10-IPC_A]  (hidden comment: CL10C681JB8NFNC)
C319  Capacitance: 4.7u  [FP-CL10-IPC_A]  (hidden comment: CL10C681JB8NFNC)
C320  Capacitance: 4.7u  [FP-CL10-IPC_A]  (hidden comment: CL10C681JB8NFNC)
C321  Capacitance: 0.1u  [FP-CL94-IPC_C]  (hidden comment: CL05B104KQ5NNNC)
C322  Capacitance: 0.1u  [FP-CL94-IPC_C]  (hidden comment: CL05B104KQ5NNNC)
C323  Capacitance: 1u  [FP-CL10-IPC_A]  (hidden comment: CL10C681JB8NFNC)
C324  Capacitance: 2.2u  [FP-CL10-IPC_A]  (hidden comment: CL10C681JB8NFNC)
C325  Capacitance: 2.2u  [FP-CL10-IPC_A]  (hidden comment: CL10C681JB8NFNC)
C326  Capacitance: 0.1u  [FP-CL94-IPC_C]  (hidden comment: CL05B104KQ5NNNC)
C327  Capacitance: 1u  [FP-CL10-IPC_A]  (hidden comment: CL10C681JB8NFNC)
C328  Capacitance: 0.1u  [FP-CL10-IPC_A]  (hidden comment: CL10C681JB8NFNC)
C329  Capacitance: 0.1u  [FP-CL10-IPC_A]  (hidden comment: CL10C681JB8NFNC)
LS300  TE034003-1  [XDCR_TE034003-1]
Q300  UT6MA3TCR  [TRANS_UT6J3_ROM]
R300  value 500R  [FP-CPF0603-MFG]  (hidden comment: CPF0603B2K15E1)
R301  value 10kR  [FP-CPF0603-MFG]  (hidden comment: CPF0603B2K15E1)
R302  value 10kR  [FP-CPF0603-MFG]  (hidden comment: CPF0603B2K15E1)
R303  value 10kR  [FP-CPF0603-MFG]  (hidden comment: CPF0603B2K15E1)
R304  value 10kR  [FP-CPF0603-MFG]  (hidden comment: CPF0603B2K15E1)
R305  value 10kR  [FP-CPF0603-MFG]  (hidden comment: CPF0603B2K15E1)
R306  value 207R  [FP-CPF0603-MFG]  (hidden comment: CPF0603B2K15E1)
R307  value 10kR  [FP-CPF0603-MFG]  (hidden comment: CPF0603B2K15E1)
R308  value 10kR  [FP-CPF0603-MFG]  (hidden comment: CPF0603B2K15E1)
R309  value 10kR  [FP-CPF0603-MFG]  (hidden comment: CPF0603B2K15E1)
SW300  PTS636SL43SMTRLFS  [SW_PTS636S-J_CNK]  (value not drawn)
SW301  PTS636SL43SMTRLFS  [SW_PTS636S-J_CNK]  (value not drawn)
SW302  PTS636SL43SMTRLFS  [SW_PTS636S-J_CNK]  (value not drawn)
U300  STM32H745ZIT3  [LQFP-144]  (parts A,B,C of 3)
U301  STM8S003F3P6TR  [SOP65P640X120-20N]
U302  W25Q128FVSIG  [WINB-SOIC-8_M]
Y300  830108213509  [WE-XTAL_IQXC-42]  (value not drawn)

### Blocks framed on the sheet
Misc: C300 C301 LS300 Q300 R300-R309 SW300-SW302 Y300
Main IO: U300
MCU Power: C302-C326 U300
Backup MCU: C327 C328 U301
Flash: C329 U302

### Nets
3V3: C302.1 C303.1 C304.1 C305.1 C306.1 C307.1 C308.1 C309.1 C310.1 C311.1 C312.1 C313.1 C314.1 C315.1 C316.1 C317.1 C318.1 C319.1 C320.1 C323.1 C326.1 C328.1 C329.1 Q300.6 Q300.7 R305.2 R307.1 R308.2 SW300.2 SW301.2 SW302.2 U300.7(VDD) U300.8(VBAT) U300.13(VDD) U300.19(VDD) U300.32(VDD) U300.35(VREF+) U300.36(VDDA) U300.42(VDD) U300.56(VDD) U300.70(VDDLDO) U300.71(VDD) U300.79(VDD) U300.92(VDD) U300.105(VDDLDO) U300.106(VDD) U300.119(VDD) U300.129(VDD) U300.143(VDDLDO) U300.144(VDD) U301.9(VDD) U302.8(VCC)
GND: C300.2 C301.2 C302.2 C303.2 C304.2 C305.2 C306.2 C307.2 C308.2 C309.2 C310.2 C311.2 C312.2 C313.2 C314.2 C315.2 C316.2 C317.2 C318.2 C319.2 C320.2 C321.2 C322.2 C323.2 C324.2 C325.2 C326.2 C327.2 C328.2 C329.2 LS300.1(NEG) Q300.3 Q300.4 Q300.5 Q300.8 R301.2 R302.1 R303.1 R304.1 R309.2 U300.6(VSS) U300.12(VSS) U300.18(VSS) U300.33(VSS) U300.34(VSSA) U300.41(VSS) U300.55(VSS) U300.69(VSS) U300.80(VSS) U300.89(VSS) U300.104(VSS) U300.118(VSS) U300.128(VSS) U300.141(VSS) U301.7(VSS) U302.4(GND) Y300.2(GND) Y300.4(GND)  [project net Pyro1-]
5V_SW1: U300.43(PA4)
5V_SW2: U300.47(PC4)
/GPS_RESET: U300.112(PD0)
/GPS_SAFEBOOT: U300.113(PD1)
ACC1_INT1: U300.136(PB8)
ACC1_INT2: U300.137(PB9)
ACC2_INT1: U300.138(PE0)
ACC2_INT2: U300.139(PE1)
ADC_CLK: U300.95(PC8)
ADC_DOUT: U300.28(PC0)
ADC_GAIN_0: U300.94(PC7)
ADC_GAIN_1: U300.96(PC9)
ADC_MUX_0: U300.93(PC6)
ADC_PDWN: U300.30(PC2_C)
ADC_SCLK: U300.5(PE6)
ADC_SPEED: U300.31(PC3_C)
BOOTLOAD: R304.2 SW302.1 U300.135(BOOT0)
Buzzer: R300.1 U300.82(PD12)
Cont1: U300.61(PE11)
Cont2: U300.54(PF15)
Cont3: U300.57(PE7)
Cont4: U300.58(PE8)
Cont5: U300.60(PE10)
FLASH_CLK: U300.24(PF10) U302.6(CLK)
FLASH_CS: U300.11(PC15-OSC32_OUT) U302.1(~{CS})
FLASH_IO0: U300.22(PF8) U302.5(DI_(IO0))
FLASH_IO1: U300.23(PF9) U302.2(DO_(IO1))
FLASH_IO2: U300.21(PF7) U302.3(~{WP}_(IO2))
FLASH_IO3: U300.20(PF6) U302.7(~{HOLD}/~{RESET}_(IO3))
GPS_INT: U300.111(PC12)
GPS_RX: U300.109(PC10)
GPS_TX: U300.110(PC11)
GYRO_INT1: U300.132(PB5)
GYRO_INT2: U300.131(PB4)
HV1_MCU: U300.52(PF11)
HV2_MCU: U300.53(PF14)
I2C_SCL: R308.1 U300.133(PB6) U301.12(PB4(T)/I2C_SCL(ADC_ETR))
I2C_SDA: R305.1 U300.134(PB7) U301.11(PB5(T)/I2C_SDA(TIM1_BKIN))
Ignite1: U300.63(PE13) U301.19(PD2(HS)/AIN3/(TIM2_CH3))
Ignite2: U300.64(PE14) U301.14(PC4(HS)/TIM1_CH4/CLK_CCO/AIN2/(TIM1_CH2N))
Ignite3: U300.65(PE15)
Ignite4: U300.66(PB10)
Ignite5: U300.67(PB11)
LORA_BUSY: U300.100(PA11)
LORA_DIO: U300.101(PA12)
LORA_SEL: U300.99(PA10)
MCU_VCAP1: C325.1 U300.68(VCAP)
MCU_VCAP2: C324.1 U300.103(VCAP) U300.140(VCAP)
MCU_Watchdog: U300.84(PD14) U301.13(PC3(HS)/TIM1_CH3(TLI)(TIM1_CH1N))
NRST: R307.2 U300.27(NRST)
OSC_IN: C301.1 U300.25(PH0-OSC_IN) Y300.3(Crystal)
OSC_OUT: R306.1 U300.26(PH1-OSC_OUT)
OTG_HS_VBUS: C322.1 U300.73(PB13) U300.90(VDD50USB)
Pyro Active: U300.62(PE12)
SD Detect: U300.37(PA0)
Servo1: U300.38(PA1)
Servo2: U300.39(PA2)
Servo3: U300.40(PA3)
Servo4: U300.49(PB0)
Servo5: U300.50(PB1)
Servo6: U300.59(PE9)
SPI_CS1: U300.97(PA8)
SPI_CS2: U300.98(PA9)
SPI_MISO: U300.45(PA6) U301.17(PC7(HS)/SPI_MISO(TIM1_CH2))
SPI_MOSI: U300.46(PA7) U301.16(PC6(HS)/SPI_MOSI(TIM1_CH1))
SPI_SCK: U300.44(PA5) U301.15(PC5(HS)/SPI_SCK(TIM2_CH1))
SW1: R302.2 SW300.1 U300.9(PC13)
SW2: R303.2 SW301.1 U300.29(PC1)
SWCLK: U300.107(PA14)
SWDIO: U300.102(PA13)
SWIM: U301.18(PD1(HS)/SWIM)
SWO: U300.130(PB3)
Themo_Int_1: U300.1(PE2)
Themo_Int_2: U300.2(PE3)
Themo_Int_3: U300.3(PE4)
Themo_Int_4: U300.4(PE5)
USB_HS_N: U300.74(PB14)
USB_HS_P: U300.75(PB15)
NetC300_1: C300.1 R306.2 Y300.1(Crystal)
NetC321_1: C321.1 U300.91(VDD33USB)
NetC327_1: C327.1 U301.8(VCAP)
NetLS300_2: LS300.2(POS) Q300.1 R309.1
NetQ300_2: Q300.2 R300.2 R301.1

Not connected (* = marked no-connect by the designer): U300 10(PC14-OSC32_IN)* 14(VSSSMPS)* 15(VLXSMPS)* 16(VDDSMPS)* 17(VFBSMPS)* 48(PC5) 51(PB2) 72(PB12) 76(PD8) 77(PD9) 78(PD10) 81(PD11) 83(PD13) 85(PD15) 86(PG6) 87(PG7) 88(PG8) 108(PA15) 114(PD2) 115(PD3) 116(PD4) 117(PD5) 120(PD6) 121(PD7) 122(PG9) 123(PG10) 124(PG11) 125(PG12) 126(PG13) 127(PG14) 142(PDR_ON); U301 1(PD4(HS)/BEEP/TIM2_CH1/UART1_CK) 2(PD5(HS)/AIN5/UART1_TX) 3(PD6(HS)/AIN6/UART1_RX) 4(NRST) 5(PA1/OSCIN) 6(PA2/OSCOUT) 10(PA3(HS)/TIM2_CH3(SPI_NSS)) 20(PD3(HS)/AIN4/TIM2_CH2/ADC_ETR)

### Notes on the sheet
- @{"Id":"VQSDYBLF\JBDHTBJV","ObjectType":2} or 0 ohm
- Main MCU
- Sensor and Pyro IO we still need to connect
- High speed ceramic capacitors
  Get 0R resistor for Rext. May not be needed
- @{"Id":"VQSDYBLF\DMKKTRWW","ObjectType":2}
  2 Vcap Pins need caps. Connect 3rd Vcap pin to one or both Vcap pins.
  Change as needed for PCB layout
- Backup MCU
- What GPS/telemtry pins should be connected to backup MCU?
- (in symbol CMP-009-00178-3) NPN; PNP
- (in symbol CMP-028-000001-2, part A) 1 of 2
- (in symbol CMP-028-000001-2, part B) 2 of 2
- (in symbol CMP-028-000001-2, part C) 3 of 3

### Library data of the parts
C300 C301 C315 C316 C318-C320 C323-C325 = CMP-13271-001533-1: as C200 on sheet Sensors; Voltage Rating: 50V; Radiation Hardening: No; Length: 0.063inch; Min Operating Temperature: -55°C; Package Quantity: 1; Lead Free: Lead Free; Case Code (Metric): 1608; Thickness: 0.035inch; Width: 0.031inch; Height: 0.8mm; Case/Package: 0603; Tolerance: 5%; Mount: Surface Mount; Dielectric: C0G; Max Operating Temperature: 125°C; Case Code (Imperial): 0603; Packaging: Tape and Reel; Depth: 0.8mm
C302-C314 C317 C321 C322 C326 = CMP-13271-000088-1: Cap Ceramic 100nF 6.3V X7R ±10% SMD 0402 +125°C Paper T/R; Tolerance: 10%; Thickness: 0.022inch; Case Code (Metric): 1005; Dielectric: X7R; Case/Package: 0402; Min Operating Temperature: -55°C; Voltage Rating (DC): 6.3V; Radiation Hardening: No; Voltage Rating: 6.3V; Depth: 0.5mm; Length: 1mm; Case Code (Imperial): 0402; Mount: Surface Mount; Width: 0.02inch; Height: 0.5mm; Max Operating Temperature: 125°C; Lead Free: Lead Free; Packaging: Tape and Reel
C327-C329 = CMP-13271-001533-1: Cap Ceramic 680pF 50V C0G ±5% Pad SMD 0603 +125°C T/R; Dielectric: X7R; Voltage Rating: 50V; Radiation Hardening: No; Length: 0.063inch; Min Operating Temperature: -55°C; Package Quantity: 1; Lead Free: Lead Free; Case Code (Metric): 1608; Thickness: 0.035inch; Width: 0.031inch; Height: 0.8mm; Case/Package: 0603; Tolerance: 5%; Mount: Surface Mount; Max Operating Temperature: 125°C; Case Code (Imperial): 0603; Packaging: Tape and Reel; Depth: 0.8mm
LS300 = CMP-141-000000-1: Buzzers Transducer, Externally Driven Electromechanical 3 V 120mA 4kHz 64dB @ 3V, 10cm Surface Mount Solder Pads; MF: DB Unlimited; Package: DB Unlimited; Pin Count: 2; MP: TE034003-1; Design Item ID: TE034003-1; Check_prices: https://www.snapeda.com/parts/TE034003-1/DB+Unlimited/view-part/?ref=eda; Component Type: Standard; Value: *; SnapEDA_Link: https://www.snapeda.com/parts/TE034003-1/DB+Unlimited/view-part/?ref=snap; Source: TE034003-1.SchLib
Q300 = CMP-009-00178-3: No Description Available; Mfr_Name: ROHM Semiconductor; Type: Type; Design Item ID: UT6MA3TCR; RefDes: RefDes; Source: UT6MA3TCR.SchLib
R300-R309 = CMP-03211-008657-1: as R100 on sheet Power Supply; Height: 0.55mm; Series: CPF; ComponentLink2Description: Datasheet; Package: CPF0603; Automotive: No; octopart_url: https://octopart.com/cpf0603b2k15e1-te+connectivity-22739551; Lead Free: Yes; Temperature: -55°C to +155°C; RoHS: TRUE; Ipc Land Pattern Name: RESC15580X45; Temperature Range Low: -55°C; Composition: Thin Film; Device Class L3: Chip SMD Resistors; Category: Res; Octopart: https://octopart.com/cpf0603b2k15e1-te+connectivity-22739551; Resistance: 2.15KΩ; ComponentLink2URL: https://www.te.com/commerce/DocumentDelivery/DDEController?Action=showdoc&DocId=Data+Sheet%7F1773200%7FM%7Fpdf%7FEnglish%7FENG_DS_1773200_M.pdf%7F3-1676481-2; Manufacturer Part Number: CPF0603B2K15E1; packaging: 1k Reel; Tolerance: 0.1%; Temperature Range High: +155°C; Device Class L1: Passive Components; Device Class L2: Resistors
SW300-SW302 = CMP-011-00042-1: No Description Available; Mfr_Name: C&K Components; Digi-Key_Part_Number_1: CKN12309-2-ND; Digi-Key_Part_Number_2: CKN12309-1-ND; Design Item ID: PTS636SL43SMTRLFS; Source: PTS636SL43SMTRLFS.SchLib; Type: Tactile Switches; Digi-Key_Part_Number_3: CKN12309-6-ND
U300 = CMP-028-000001-2: 32-bit Dual Core, 144 Pin, 97 IO, 1M RAM, 2M Flash; Mfr_Name: STMicroelectronics; RefDes: RefDes; Design Item ID: STM32H745ZIT3; Type: Type; RoHS Compliant: Yes; Source: STM32H745ZIT3.SchLib; PartId: 1
U301 = CMP-031-00008-2: STM8 STM8S Microcontroller IC 8-Bit 16MHz 8KB (8K x 8) FLASH 20-TSSOP; MF: STMicroelectronics; MP: STM8S003F3P6TR; Source: STM8S003F3P6TR.SchLib; Value: *; Case/Package: TSSOP-20 STMicroelectronics; Availability: Good; SnapEDA_Link: https://www.snapeda.com/parts/STM8S003F3P6TR/STMicroelectronics/view-part/214129/?ref=snap; Price: None; Design Item ID: STM8S003F3P6TR; Purchase-URL: https://pricing.snapeda.com/search/part/STM8S003F3P6TR/?ref=eda
U302 = CMP-2000-05005-1: 3V 128M-Bit Serial Flash Memory with Dual/Quad SPI & QPI, 2.7 to 3.6 V, -40 to 85 degC, 8-Pin SOIC, RoHS, Tape and Reel; Manufacturer: Winbond; Number of Words: 16777216; Address Bus: 24b; Word Size: 8b; Boot Type: NotRequired; Supply Current: 20mA; Operating Supply Voltage (Max): 3.6V; Sync/Async: Synchronous; Rad Hardened: No; Interface Type: Serial(SPI); Access Time (Max): 7ns; Operating Supply Voltage (Min): 2.7V; Operating Supply Voltage (Typ): 3/3.3V; Programmable: Yes; Density: 134217728Bit; Cell Type: NOR; Package Description: 8-Pin Small Outline Integrated Circuit, Body 5.28 x 5.28 mm, Pitch 1.27 mm; Datasheet URL: http://download.siliconexpert.com/pdfs/2015/11/30/6/42/17/890/win_/manual/3w25q128fv20rev.l2008242015.pdf; Package Reference: SS-8; Package Type: SOICW; Datasheet Version: Rev. L, 08/2015; Manufacturer URL: http://www.winbond.com/hq/index.html?__locale=en; Pin Count: 8; Operating Temperature Classification: Industrial; Operating Temperature (Min): -40C; Program/Erase Volt (Typ): 2.7to3.6V; Operating Temperature (Max): 85C; Mounting: SurfaceMount; Operating Temp Range: -40Cto85C
Y300 = CMP-003-00030-1: WE-XTAL Quartz Crystal, SMT, IQXC-42, 48MHz, +/-10ppm; Manufacturer: Wurth Elektronik; Load Capacitance: 8pF; Frequency Stability: +/-15ppm; ComponentLink1Description: Website Link; Length: 2mm; Match Code: WE-XTAL; Frequency Tolerance: +/-10ppm; Packaging: Tape and Reel; ComponentLink2Description: Datasheet Link; Case/Package: IQXC-42; Source: WE-XTAL.SchLib; Width: 1.6mm; Manufacturer Part Number: 830108213509; Operating Temperature Max: 85°C; Frequency: 48MHz; Pins: 4; Category: Crystals; Height: 0.5mm; ComponentLink2URL: https://www.we-online.com/redexpert/spec/830108213509?ad; ComponentLink1URL: https://www.we-online.com/redexpert/article/830108213509?ad; Operating Temperature Min: -40°C; Component Type: Standard; Design Item ID: 830108213509; Mount: Surface Mount

## Sheet Pyro.SchDoc
size C; SheetNumber: 5; SheetTotal: 7
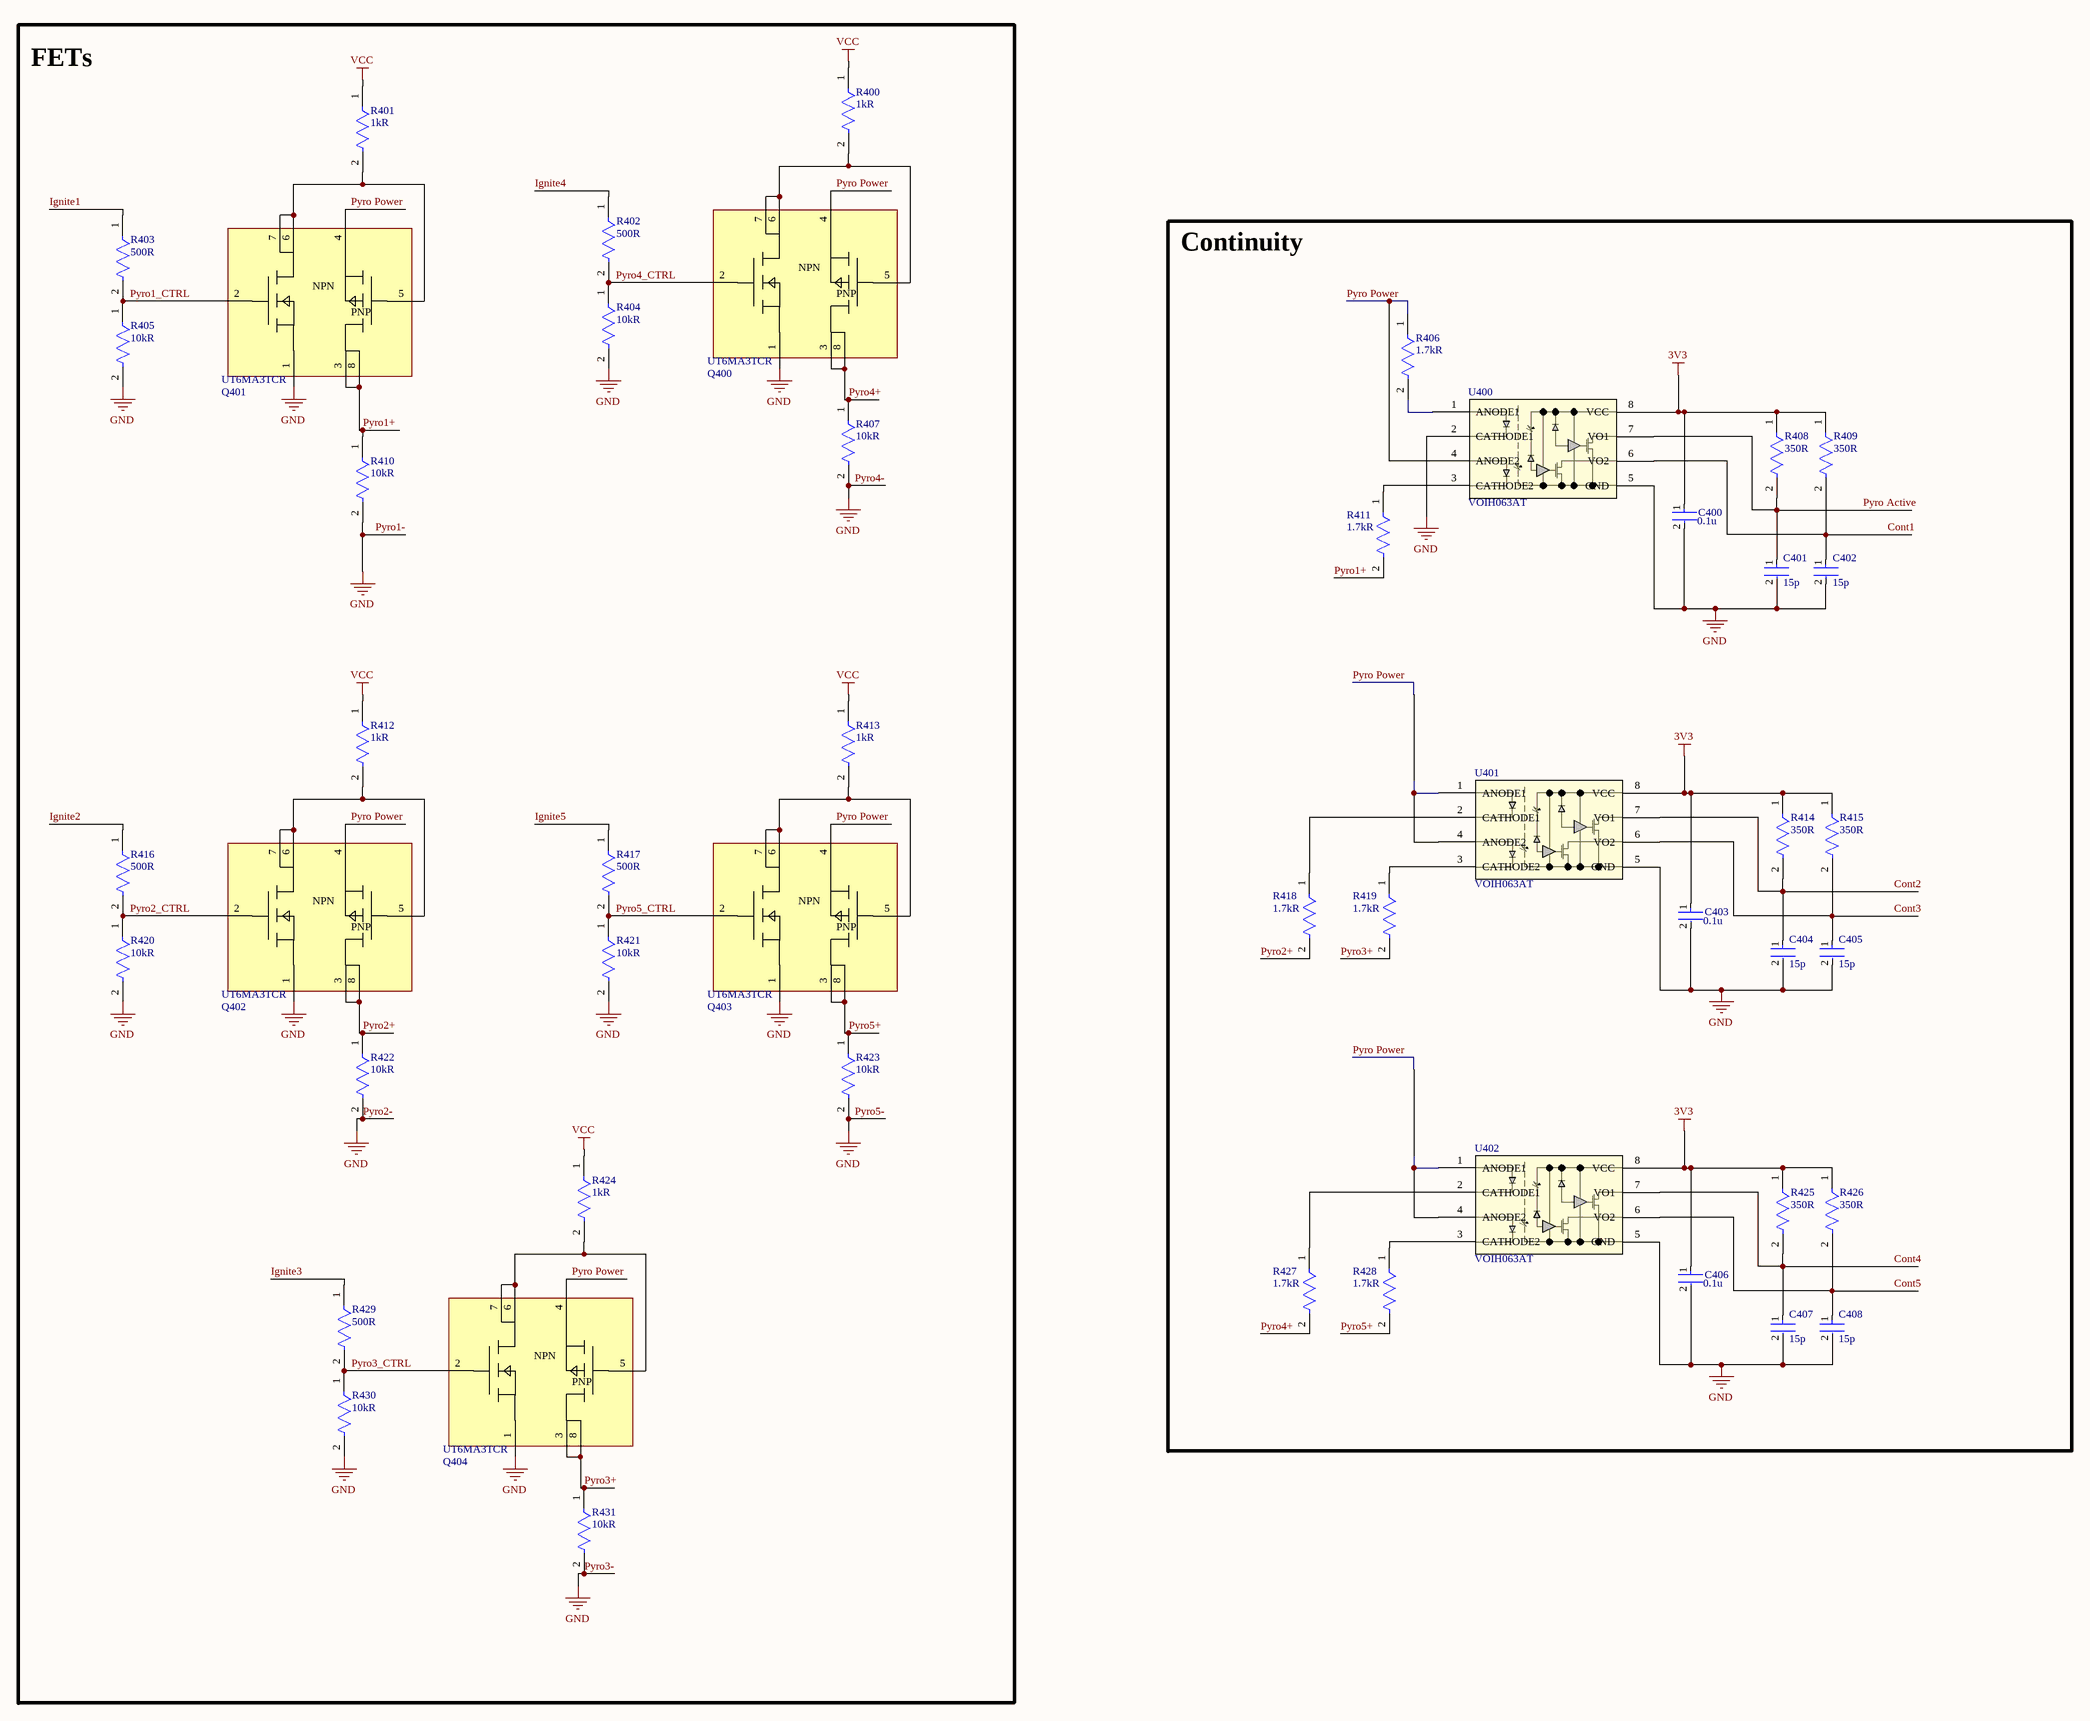
[diagram p6: Pyro.SchDoc]

### Parts
C400  Capacitance: 0.1u  [FP-CL94-IPC_C]  (hidden comment: CL05B104KQ5NNNC)
C401  Capacitance: 15p  [FP-CL10-IPC_A]  (hidden comment: CL10C681JB8NFNC)
C402  Capacitance: 15p  [FP-CL10-IPC_A]  (hidden comment: CL10C681JB8NFNC)
C403  Capacitance: 0.1u  [FP-CL94-IPC_C]  (hidden comment: CL05B104KQ5NNNC)
C404  Capacitance: 15p  [FP-CL10-IPC_A]  (hidden comment: CL10C681JB8NFNC)
C405  Capacitance: 15p  [FP-CL10-IPC_A]  (hidden comment: CL10C681JB8NFNC)
C406  Capacitance: 0.1u  [FP-CL94-IPC_C]  (hidden comment: CL05B104KQ5NNNC)
C407  Capacitance: 15p  [FP-CL10-IPC_A]  (hidden comment: CL10C681JB8NFNC)
C408  Capacitance: 15p  [FP-CL10-IPC_A]  (hidden comment: CL10C681JB8NFNC)
Q400  UT6MA3TCR  [TRANS_UT6J3_ROM]
Q401  UT6MA3TCR  [TRANS_UT6J3_ROM]
Q402  UT6MA3TCR  [TRANS_UT6J3_ROM]
Q403  UT6MA3TCR  [TRANS_UT6J3_ROM]
Q404  UT6MA3TCR  [TRANS_UT6J3_ROM]
R400  value 1kR  [FP-CPF0603-MFG]  (hidden comment: CPF0603B2K15E1)
R401  value 1kR  [FP-CPF0603-MFG]  (hidden comment: CPF0603B2K15E1)
R402  value 500R  [FP-CPF0603-MFG]  (hidden comment: CPF0603B2K15E1)
R403  value 500R  [FP-CPF0603-MFG]  (hidden comment: CPF0603B2K15E1)
R404  value 10kR  [FP-CPF0603-MFG]  (hidden comment: CPF0603B2K15E1)
R405  value 10kR  [FP-CPF0603-MFG]  (hidden comment: CPF0603B2K15E1)
R406  value 1.7kR  [FP-CPF0603-MFG]  (hidden comment: CPF0603B2K15E1)
R407  value 10kR  [FP-CPF0603-MFG]  (hidden comment: CPF0603B2K15E1)
R408  value 350R  [FP-CPF0603-MFG]  (hidden comment: CPF0603B2K15E1)
R409  value 350R  [FP-CPF0603-MFG]  (hidden comment: CPF0603B2K15E1)
R410  value 10kR  [FP-CPF0603-MFG]  (hidden comment: CPF0603B2K15E1)
R411  value 1.7kR  [FP-CPF0603-MFG]  (hidden comment: CPF0603B2K15E1)
R412  value 1kR  [FP-CPF0603-MFG]  (hidden comment: CPF0603B2K15E1)
R413  value 1kR  [FP-CPF0603-MFG]  (hidden comment: CPF0603B2K15E1)
R414  value 350R  [FP-CPF0603-MFG]  (hidden comment: CPF0603B2K15E1)
R415  value 350R  [FP-CPF0603-MFG]  (hidden comment: CPF0603B2K15E1)
R416  value 500R  [FP-CPF0603-MFG]  (hidden comment: CPF0603B2K15E1)
R417  value 500R  [FP-CPF0603-MFG]  (hidden comment: CPF0603B2K15E1)
R418  value 1.7kR  [FP-CPF0603-MFG]  (hidden comment: CPF0603B2K15E1)
R419  value 1.7kR  [FP-CPF0603-MFG]  (hidden comment: CPF0603B2K15E1)
R420  value 10kR  [FP-CPF0603-MFG]  (hidden comment: CPF0603B2K15E1)
R421  value 10kR  [FP-CPF0603-MFG]  (hidden comment: CPF0603B2K15E1)
R422  value 10kR  [FP-CPF0603-MFG]  (hidden comment: CPF0603B2K15E1)
R423  value 10kR  [FP-CPF0603-MFG]  (hidden comment: CPF0603B2K15E1)
R424  value 1kR  [FP-CPF0603-MFG]  (hidden comment: CPF0603B2K15E1)
R425  value 350R  [FP-CPF0603-MFG]  (hidden comment: CPF0603B2K15E1)
R426  value 350R  [FP-CPF0603-MFG]  (hidden comment: CPF0603B2K15E1)
R427  value 1.7kR  [FP-CPF0603-MFG]  (hidden comment: CPF0603B2K15E1)
R428  value 1.7kR  [FP-CPF0603-MFG]  (hidden comment: CPF0603B2K15E1)
R429  value 500R  [FP-CPF0603-MFG]  (hidden comment: CPF0603B2K15E1)
R430  value 10kR  [FP-CPF0603-MFG]  (hidden comment: CPF0603B2K15E1)
R431  value 10kR  [FP-CPF0603-MFG]  (hidden comment: CPF0603B2K15E1)
U400  VOIH063AT  [SOIC-8_VOIH063A_VIS]
U401  VOIH063AT  [SOIC-8_VOIH063A_VIS]
U402  VOIH063AT  [SOIC-8_VOIH063A_VIS]

### Blocks framed on the sheet
FETs: Q400-Q404 R400-R405 R407 R410 R412 R413 R416 R417 R420-R424 R429-R431
Continuity: C400-C408 R406 R408 R409 R411 R414 R415 R418 R419 R425-R428 U400-U402

### Nets
3V3: C400.1 C403.1 C406.1 R408.1 R409.1 R414.1 R415.1 R425.1 R426.1 U400.8(VCC) U401.8(VCC) U402.8(VCC)
Pyro1-: C400.2 C401.2 C402.2 C403.2 C404.2 C405.2 C406.2 C407.2 C408.2 Q400.1 Q401.1 Q402.1 Q403.1 Q404.1 R404.2 R405.2 R407.2 R410.2 R420.2 R421.2 R422.2 R423.2 R430.2 R431.2 U400.2(CATHODE1) U400.5(GND) U401.5(GND) U402.5(GND)  [also labelled GND, Pyro2-, Pyro3-, Pyro4-, Pyro5-]
VCC: R400.1 R401.1 R412.1 R413.1 R424.1
Cont1: C402.1 R409.2 U400.6(VO2)
Cont2: C404.1 R414.2 U401.7(VO1)
Cont3: C405.1 R415.2 U401.6(VO2)
Cont4: C407.1 R425.2 U402.7(VO1)
Cont5: C408.1 R426.2 U402.6(VO2)
Ignite1: R403.1
Ignite2: R416.1
Ignite3: R429.1
Ignite4: R402.1
Ignite5: R417.1
Pyro1+: Q401.3 Q401.8 R410.1 R411.2
Pyro1_CTRL: Q401.2 R403.2 R405.1
Pyro2+: Q402.3 Q402.8 R418.2 R422.1
Pyro2_CTRL: Q402.2 R416.2 R420.1
Pyro3+: Q404.3 Q404.8 R419.2 R431.1
Pyro3_CTRL: Q404.2 R429.2 R430.1
Pyro4+: Q400.3 Q400.8 R407.1 R427.2
Pyro4_CTRL: Q400.2 R402.2 R404.1
Pyro5+: Q403.3 Q403.8 R423.1 R428.2
Pyro5_CTRL: Q403.2 R417.2 R421.1
Pyro Active: C401.1 R408.2 U400.7(VO1)
Pyro Power: Q400.4 Q401.4 Q402.4 Q403.4 Q404.4 R406.1 U400.4(ANODE2) U401.1(ANODE1) U401.4(ANODE2) U402.1(ANODE1) U402.4(ANODE2)
NetQ400_5: Q400.5 Q400.6 Q400.7 R400.2
NetQ401_5: Q401.5 Q401.6 Q401.7 R401.2
NetQ402_5: Q402.5 Q402.6 Q402.7 R412.2
NetQ403_5: Q403.5 Q403.6 Q403.7 R413.2
NetQ404_5: Q404.5 Q404.6 Q404.7 R424.2
NetR406_2: R406.2 U400.1(ANODE1)
NetR411_1: R411.1 U400.3(CATHODE2)
NetR418_1: R418.1 U401.2(CATHODE1)
NetR419_1: R419.1 U401.3(CATHODE2)
NetR427_1: R427.1 U402.2(CATHODE1)
NetR428_1: R428.1 U402.3(CATHODE2)

### Notes on the sheet
- (in symbol CMP-009-00178-3) NPN; PNP

### Library data of the parts
C400 C403 C406 = CMP-13271-000088-1: as C302 on sheet MCU; Tolerance: 10%; Thickness: 0.022inch; Case Code (Metric): 1005; Dielectric: X7R; Case/Package: 0402; Min Operating Temperature: -55°C; Voltage Rating (DC): 6.3V; Radiation Hardening: No; Voltage Rating: 6.3V; Depth: 0.5mm; Length: 1mm; Case Code (Imperial): 0402; Mount: Surface Mount; Width: 0.02inch; Height: 0.5mm; Max Operating Temperature: 125°C; Lead Free: Lead Free; Packaging: Tape and Reel
C401 C402 C404 C405 C407 C408 = CMP-13271-001533-1: as C200 on sheet Sensors; Voltage Rating: 50V; Radiation Hardening: No; Length: 0.063inch; Min Operating Temperature: -55°C; Package Quantity: 1; Lead Free: Lead Free; Case Code (Metric): 1608; Thickness: 0.035inch; Width: 0.031inch; Height: 0.8mm; Case/Package: 0603; Tolerance: 5%; Mount: Surface Mount; Dielectric: C0G; Max Operating Temperature: 125°C; Case Code (Imperial): 0603; Packaging: Tape and Reel; Depth: 0.8mm
Q400-Q404 = CMP-009-00178-3: as Q300 on sheet MCU; Type: Type; Design Item ID: UT6MA3TCR; RefDes: RefDes; Source: UT6MA3TCR.SchLib
R400-R431 = CMP-03211-008657-1: as R100 on sheet Power Supply; Height: 0.55mm; Series: CPF; ComponentLink2Description: Datasheet; Package: CPF0603; Automotive: No; octopart_url: https://octopart.com/cpf0603b2k15e1-te+connectivity-22739551; Lead Free: Yes; Temperature: -55°C to +155°C; RoHS: TRUE; Ipc Land Pattern Name: RESC15580X45; Temperature Range Low: -55°C; Composition: Thin Film; Device Class L3: Chip SMD Resistors; Category: Res; Octopart: https://octopart.com/cpf0603b2k15e1-te+connectivity-22739551; Resistance: 2.15KΩ; ComponentLink2URL: https://www.te.com/commerce/DocumentDelivery/DDEController?Action=showdoc&DocId=Data+Sheet%7F1773200%7FM%7Fpdf%7FEnglish%7FENG_DS_1773200_M.pdf%7F3-1676481-2; Manufacturer Part Number: CPF0603B2K15E1; packaging: 1k Reel; Tolerance: 0.1%; Temperature Range High: +155°C; Device Class L1: Passive Components; Device Class L2: Resistors
U400-U402 = CMP-053-000000-3: No Description Available; Mfr_Name: Vishay; RefDes: RefDes; Type: Type; Source: VOIH063AT.SchLib; Design Item ID: VOIH063AT

## Sheet Misc Controls.SchDoc
size C; SheetNumber: 6; SheetTotal: 7
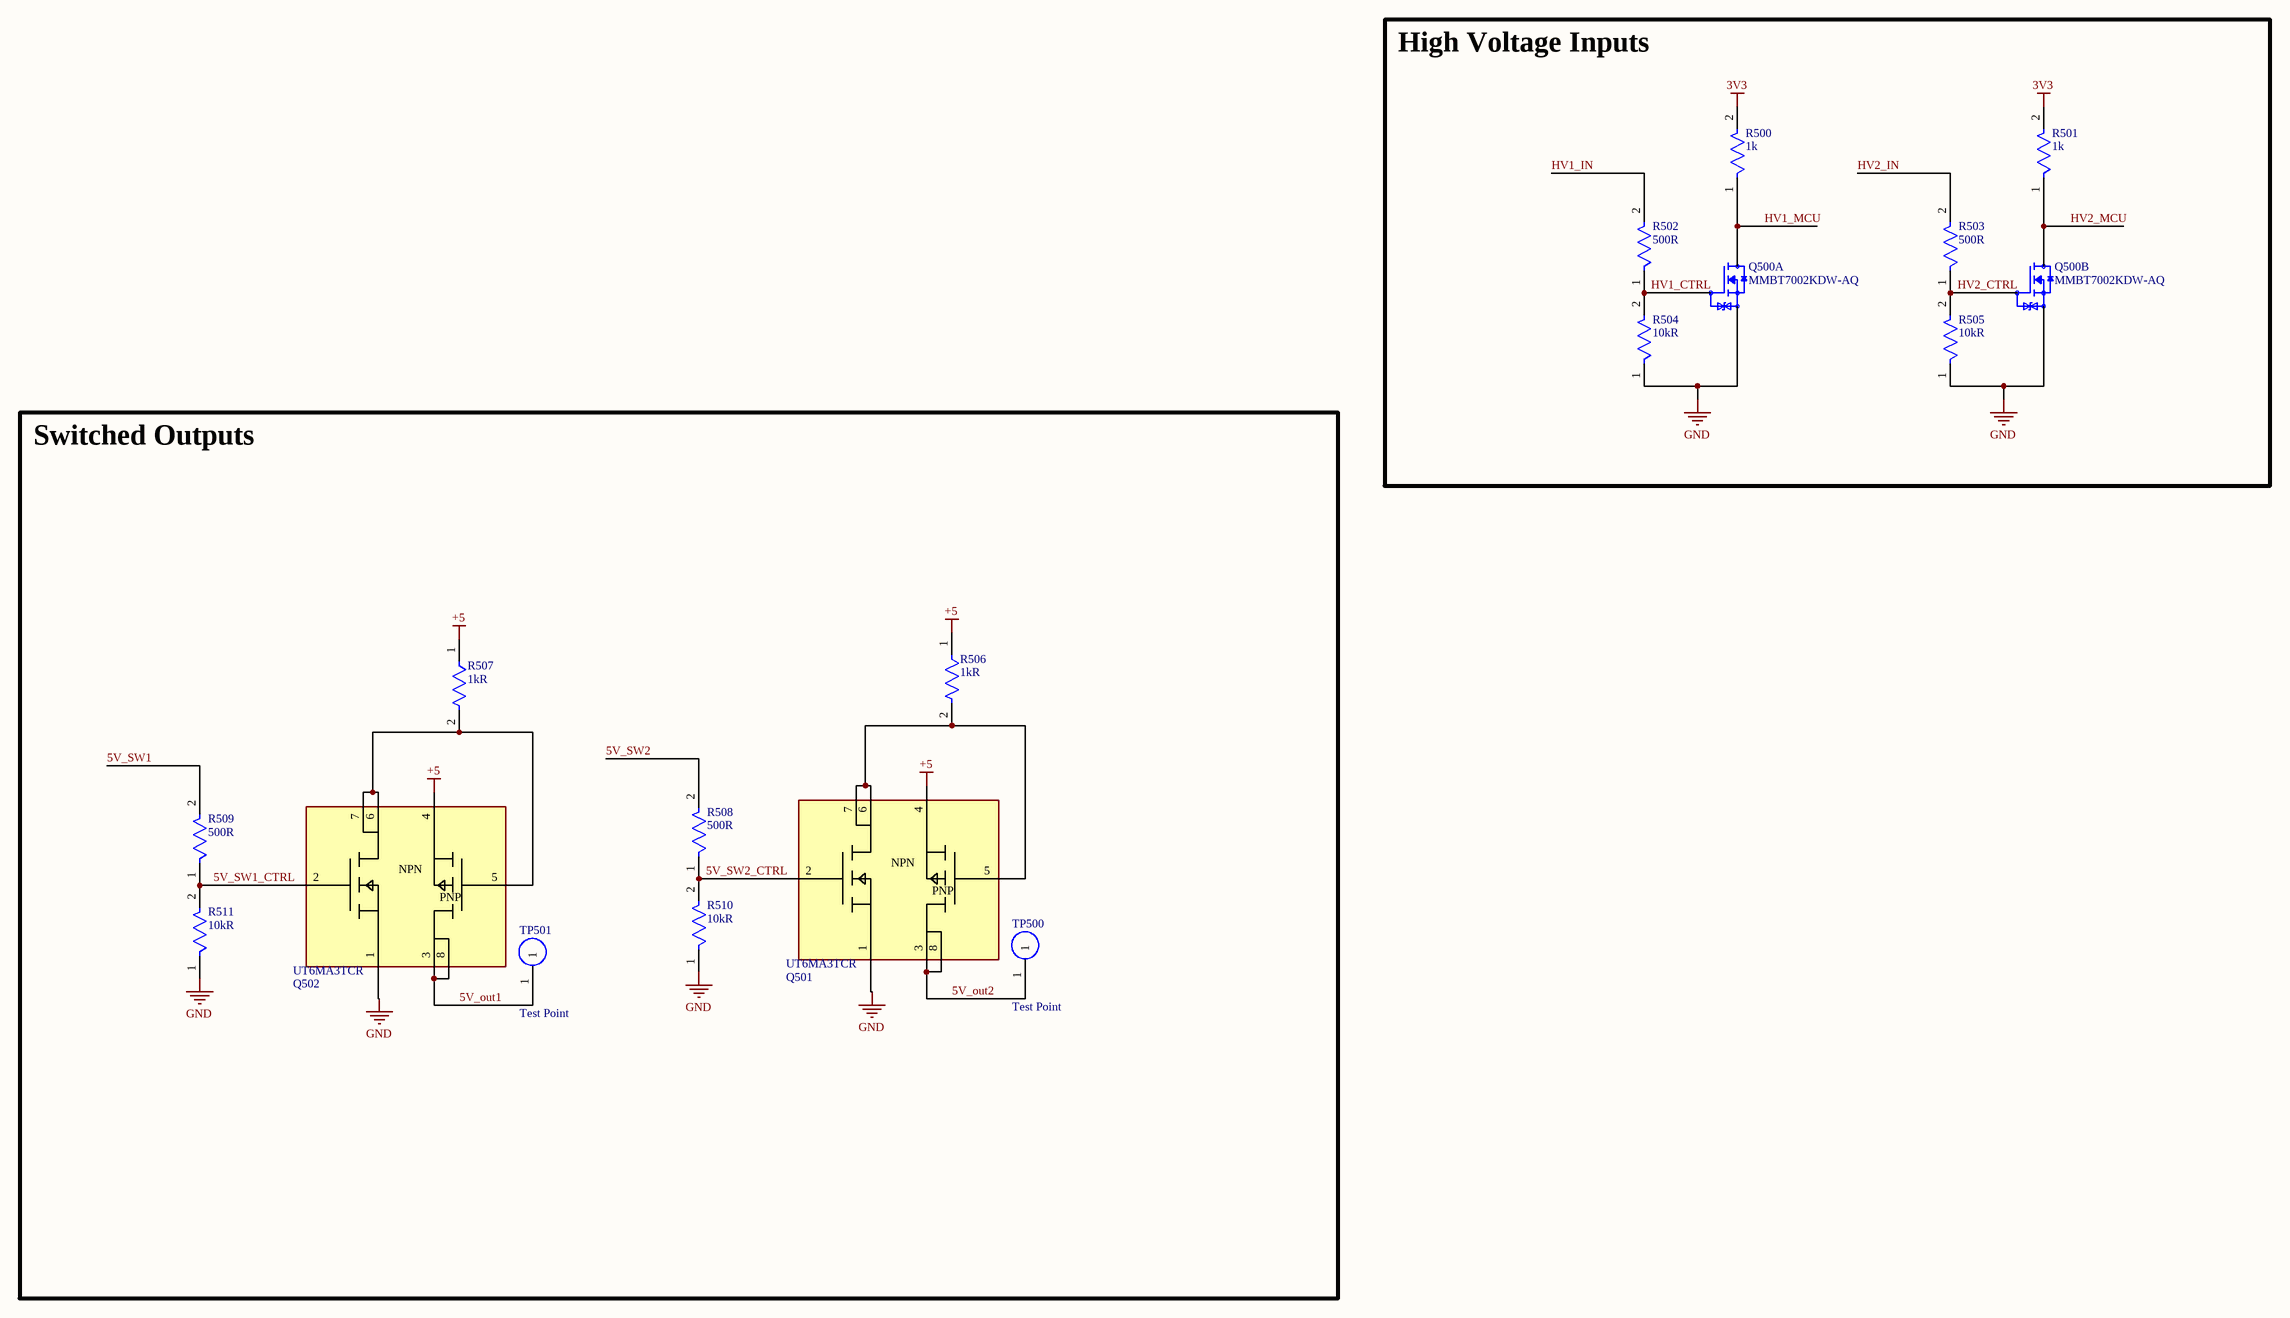
[diagram p7: Misc Controls.SchDoc]

### Parts
Q500  MMBT7002KDW-AQ  [SOT65P210X100-6N]  (parts A,B of 2)
Q501  UT6MA3TCR  [TRANS_UT6J3_ROM]
Q502  UT6MA3TCR  [TRANS_UT6J3_ROM]
R500  value 1k  [FP-CPF0603-MFG]  (hidden comment: CPF0603B2K15E1)
R501  value 1k  [FP-CPF0603-MFG]  (hidden comment: CPF0603B2K15E1)
R502  value 500R  [FP-CPF0603-MFG]  (hidden comment: CPF0603B2K15E1)
R503  value 500R  [FP-CPF0603-MFG]  (hidden comment: CPF0603B2K15E1)
R504  value 10kR  [FP-CPF0603-MFG]  (hidden comment: CPF0603B2K15E1)
R505  value 10kR  [FP-CPF0603-MFG]  (hidden comment: CPF0603B2K15E1)
R506  value 1kR  [FP-CPF0603-MFG]  (hidden comment: CPF0603B2K15E1)
R507  value 1kR  [FP-CPF0603-MFG]  (hidden comment: CPF0603B2K15E1)
R508  value 500R  [FP-CPF0603-MFG]  (hidden comment: CPF0603B2K15E1)
R509  value 500R  [FP-CPF0603-MFG]  (hidden comment: CPF0603B2K15E1)
R510  value 10kR  [FP-CPF0603-MFG]  (hidden comment: CPF0603B2K15E1)
R511  value 10kR  [FP-CPF0603-MFG]  (hidden comment: CPF0603B2K15E1)
TP500  Test Point  [2mm TP]
TP501  Test Point  [2mm TP]

### Blocks framed on the sheet
High Voltage Inputs: Q500 R500-R505
Switched Outputs: Q501 Q502 R506-R511 TP500 TP501

### Nets
3V3: R500.2 R501.2
+5: Q501.4 Q502.4 R506.1 R507.1
GND: Q500.1(S1) Q500.4(S2) Q501.1 Q502.1 R504.1 R505.1 R510.1 R511.1  [project net Pyro1-]
5V_out1: Q502.3 Q502.8 TP501.1
5V_out2: Q501.3 Q501.8 TP500.1
5V_SW1: R509.2
5V_SW1_CTRL: Q502.2 R509.1 R511.2
5V_SW2: R508.2
5V_SW2_CTRL: Q501.2 R508.1 R510.2
HV1_CTRL: Q500.2(G1) R502.1 R504.2
HV1_IN: R502.2
HV1_MCU: Q500.6(D1) R500.1
HV2_CTRL: Q500.5(G2) R503.1 R505.2
HV2_IN: R503.2
HV2_MCU: Q500.3(D2) R501.1
NetQ501_5: Q501.5 Q501.6 Q501.7 R506.2
NetQ502_5: Q502.5 Q502.6 Q502.7 R507.2

### Notes on the sheet
- (in symbol CMP-009-00178-3) NPN; PNP

### Library data of the parts
Q500 = CMP-075-000000-1: MOSFET, SOT-363, N+N, 60V, 0.3A, 3â„; MF: Diotec Semiconductor; Value: *; Package: SOT-363 Diotec; Pin Count: 6; Source: MMBT7002KDW-AQ.SchLib; SnapEDA_Link: https://www.snapeda.com/parts/MMBT7002KDW-AQ/Diotec/view-part/?ref=snap; Design Item ID: MMBT7002KDW-AQ; MP: MMBT7002KDW-AQ; Check_prices: https://www.snapeda.com/parts/MMBT7002KDW-AQ/Diotec/view-part/?ref=eda; Component Type: Standard; PartId: 1
Q501 Q502 = CMP-009-00178-3: as Q300 on sheet MCU; Type: Type; Design Item ID: UT6MA3TCR; RefDes: RefDes; Source: UT6MA3TCR.SchLib
R500-R511 = CMP-03211-008657-1: as R100 on sheet Power Supply; Height: 0.55mm; Series: CPF; ComponentLink2Description: Datasheet; Package: CPF0603; Automotive: No; octopart_url: https://octopart.com/cpf0603b2k15e1-te+connectivity-22739551; Lead Free: Yes; Temperature: -55°C to +155°C; RoHS: TRUE; Ipc Land Pattern Name: RESC15580X45; Temperature Range Low: -55°C; Composition: Thin Film; Device Class L3: Chip SMD Resistors; Category: Res; Octopart: https://octopart.com/cpf0603b2k15e1-te+connectivity-22739551; Resistance: 2.15KΩ; ComponentLink2URL: https://www.te.com/commerce/DocumentDelivery/DDEController?Action=showdoc&DocId=Data+Sheet%7F1773200%7FM%7Fpdf%7FEnglish%7FENG_DS_1773200_M.pdf%7F3-1676481-2; Manufacturer Part Number: CPF0603B2K15E1; packaging: 1k Reel; Tolerance: 0.1%; Temperature Range High: +155°C; Device Class L1: Passive Components; Device Class L2: Resistors
TP500 TP501 = CMP-096-000000-1: Source: Test_Points.SchLib; Design Item ID: Test Point